# EAGLE design 612_jetracer_328_213 (EAGLE 9.6.2)
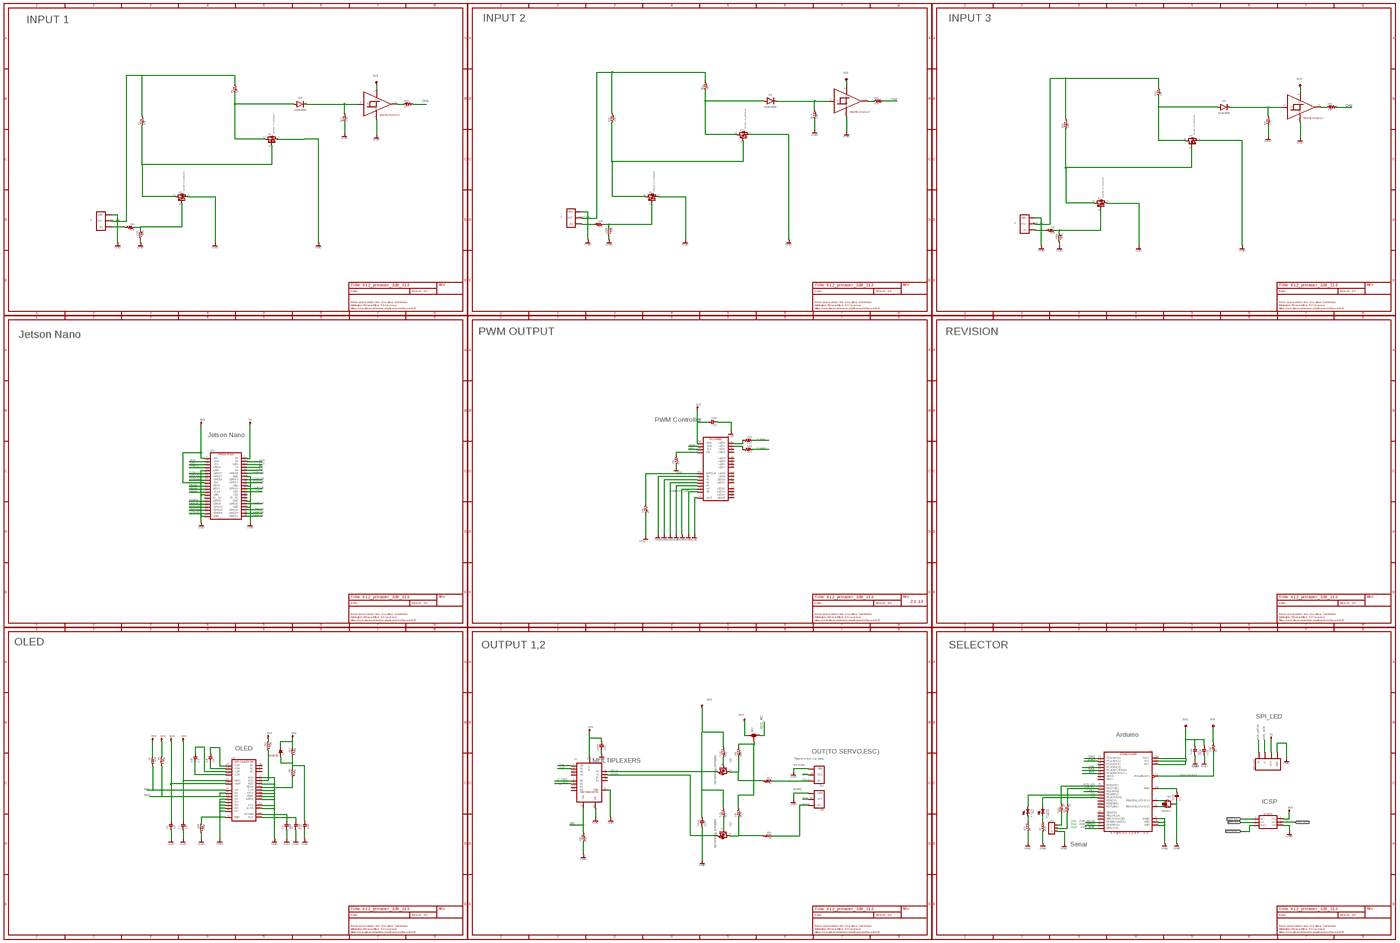
[diagram p0: schematic, sheet 1, overview]
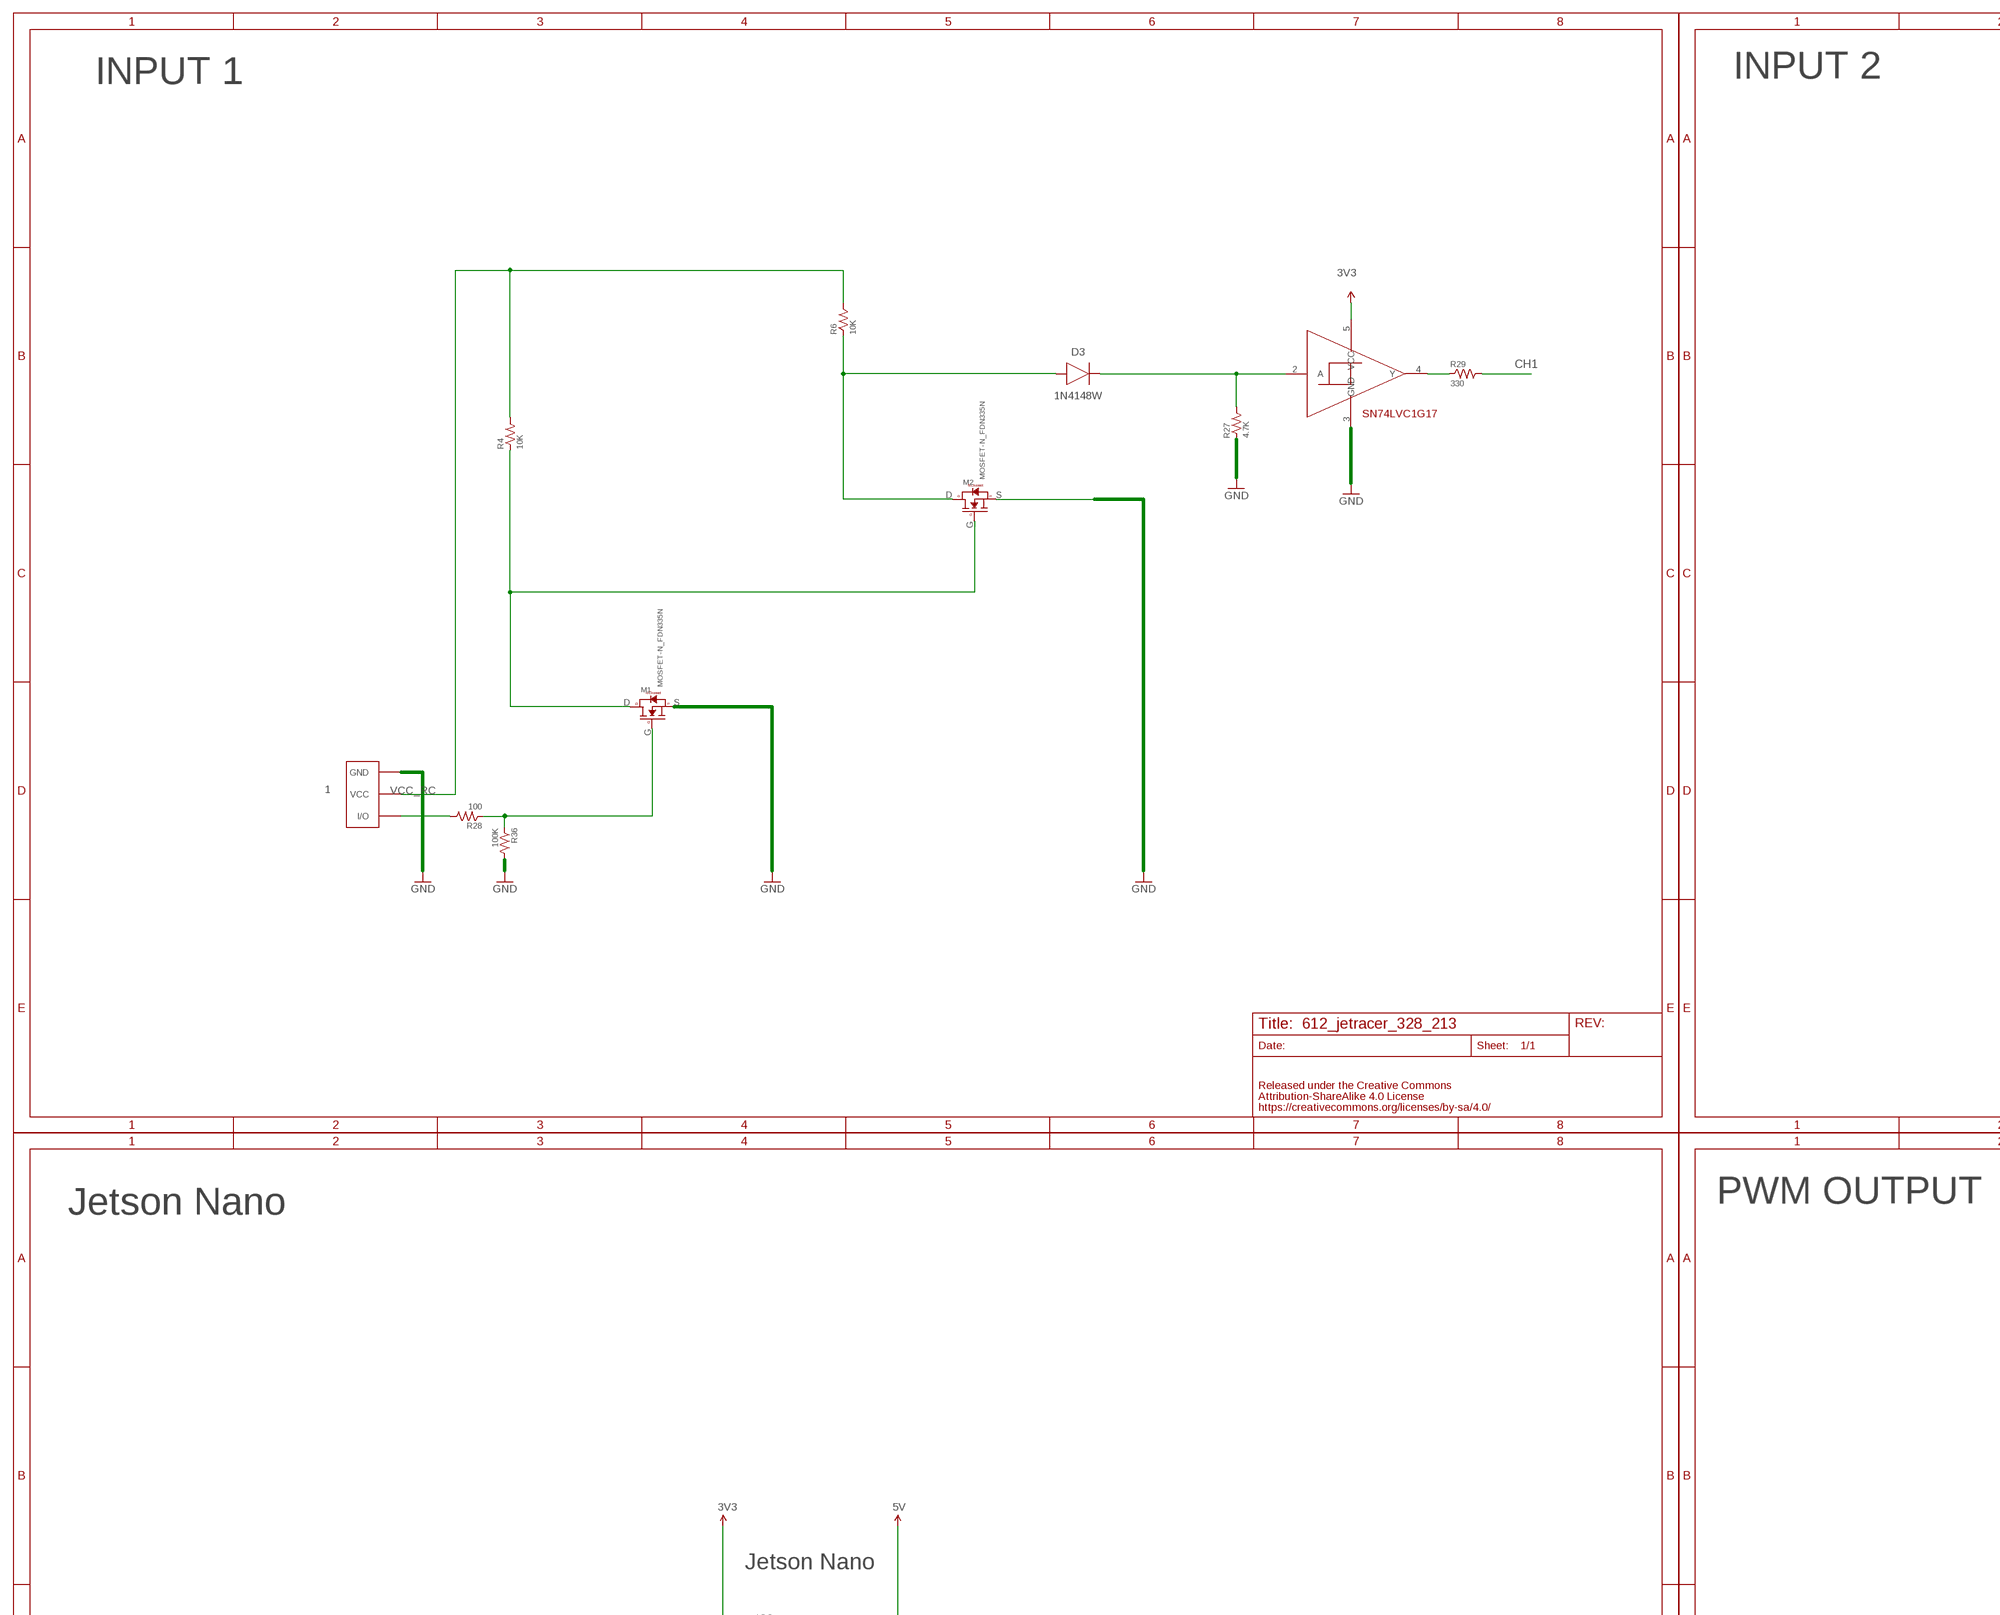
[diagram p1: schematic, sheet 1, part 1 of 6]
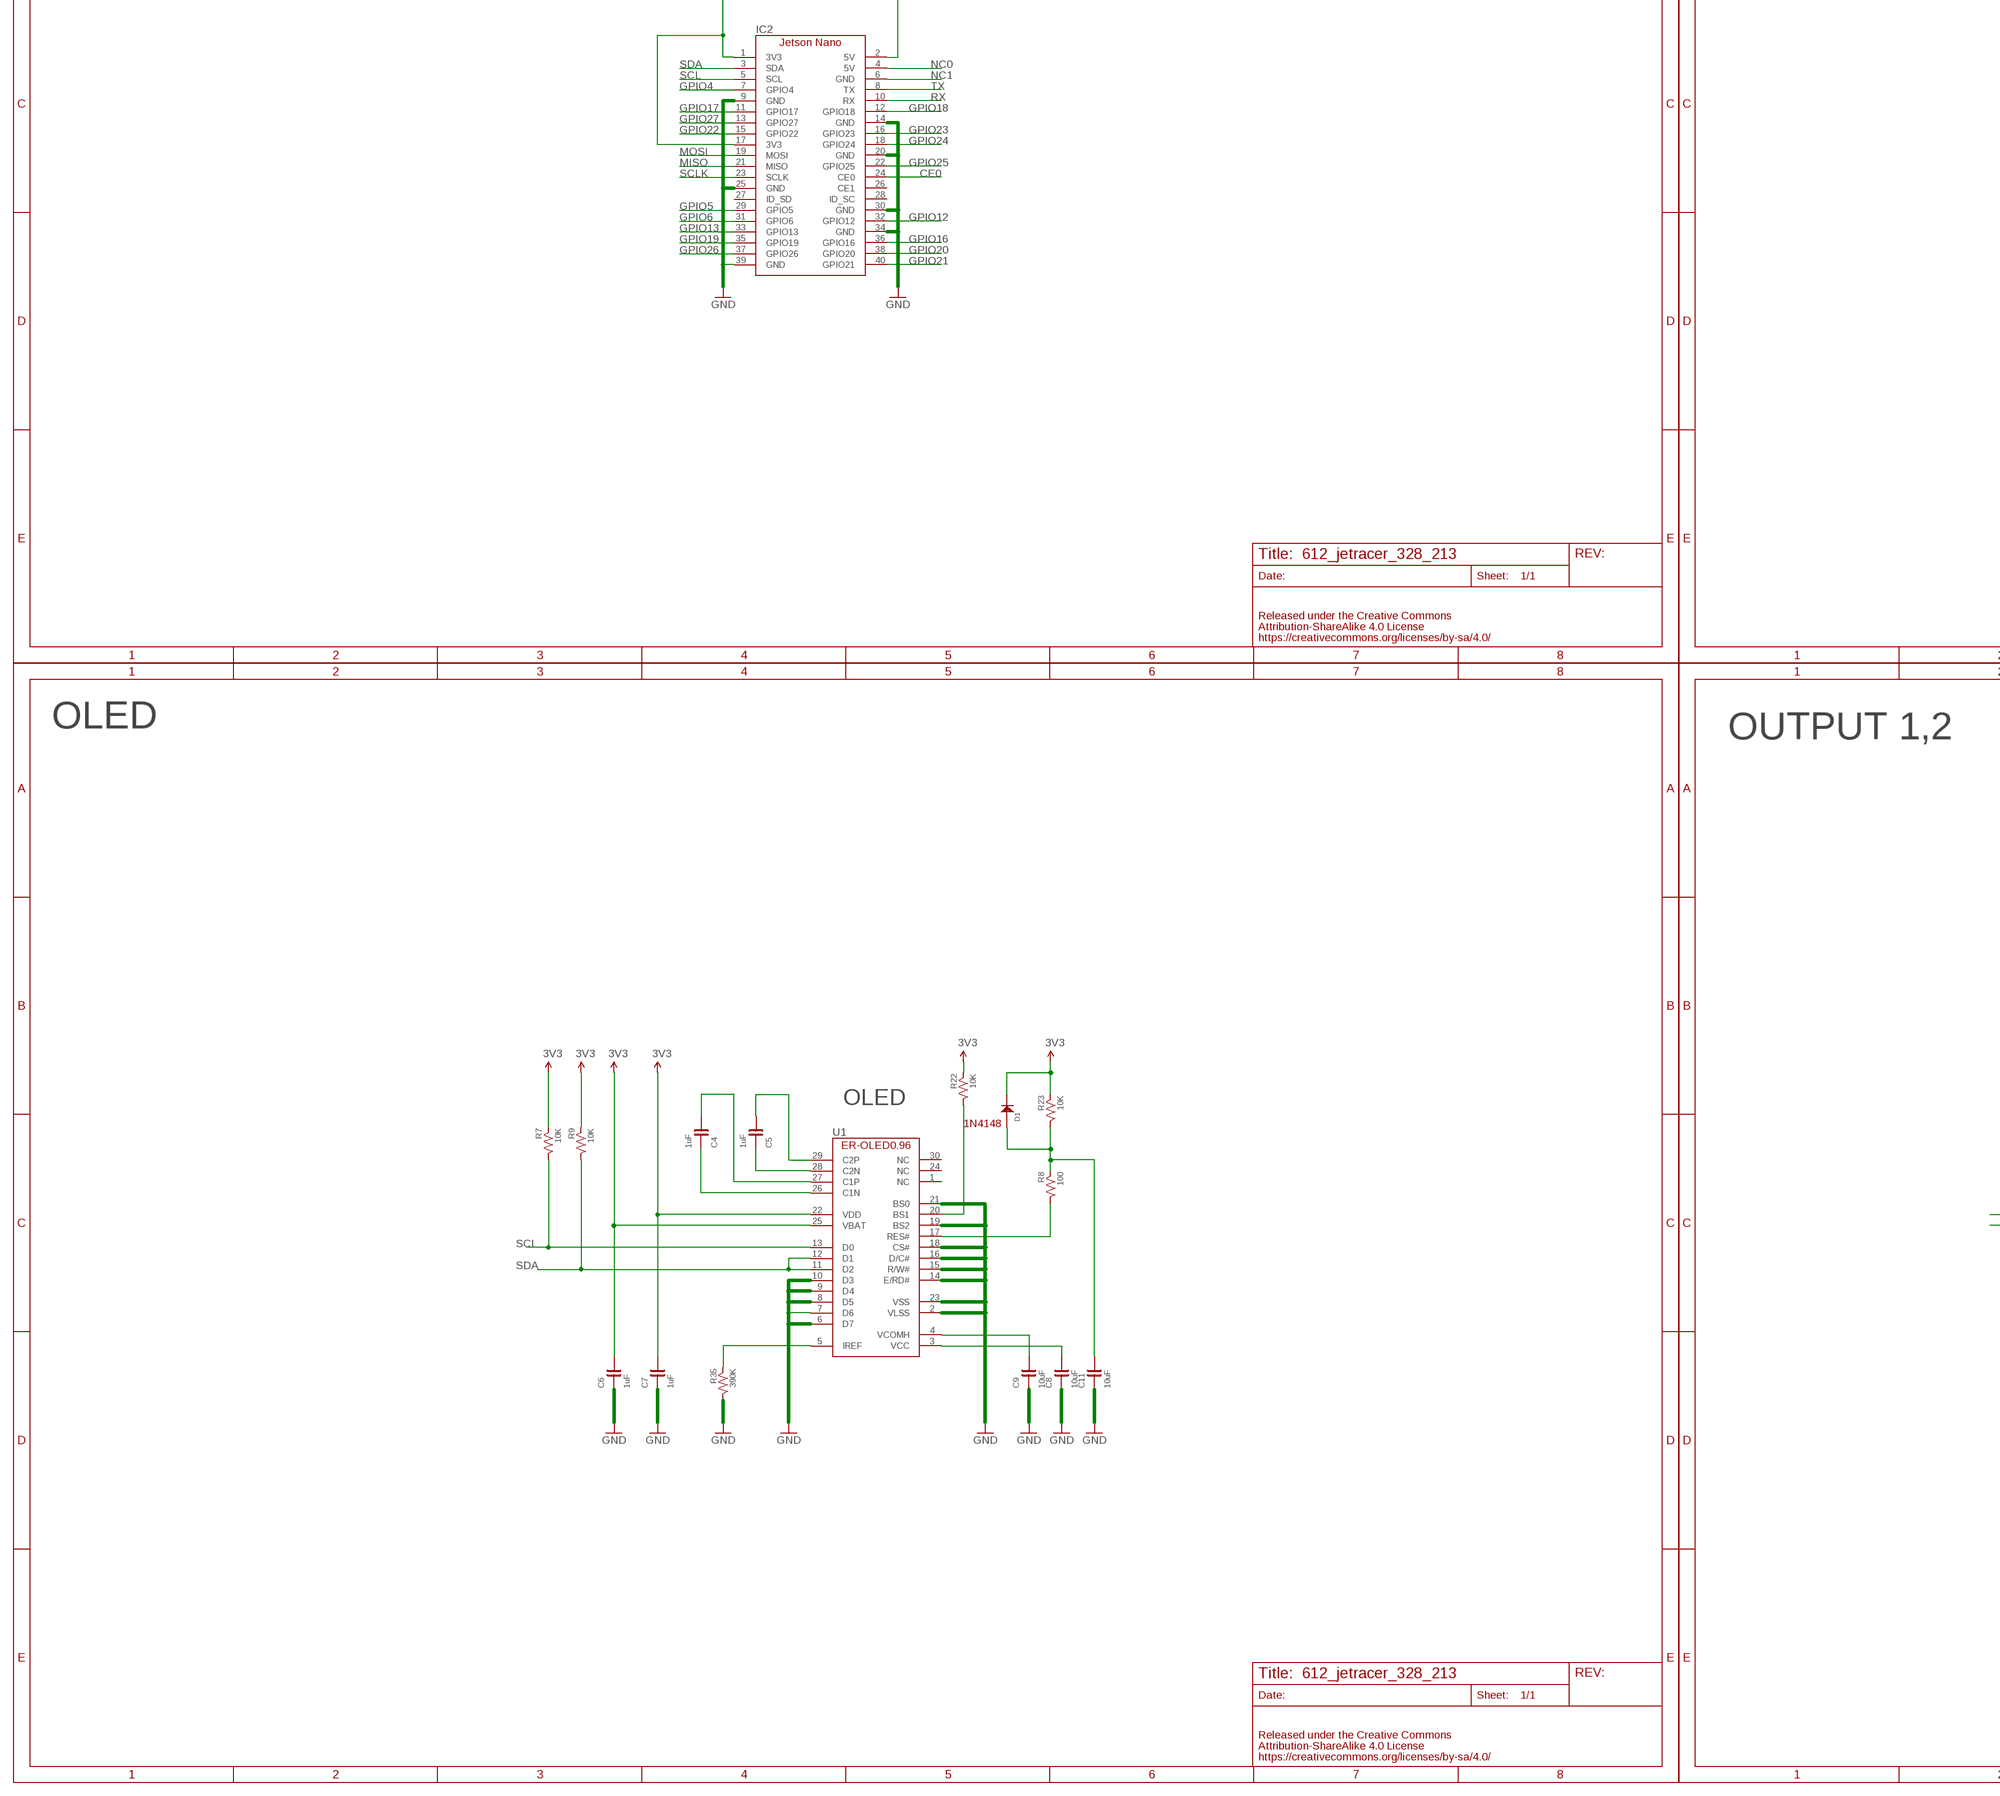
[diagram p2: schematic, sheet 1, part 2 of 6]
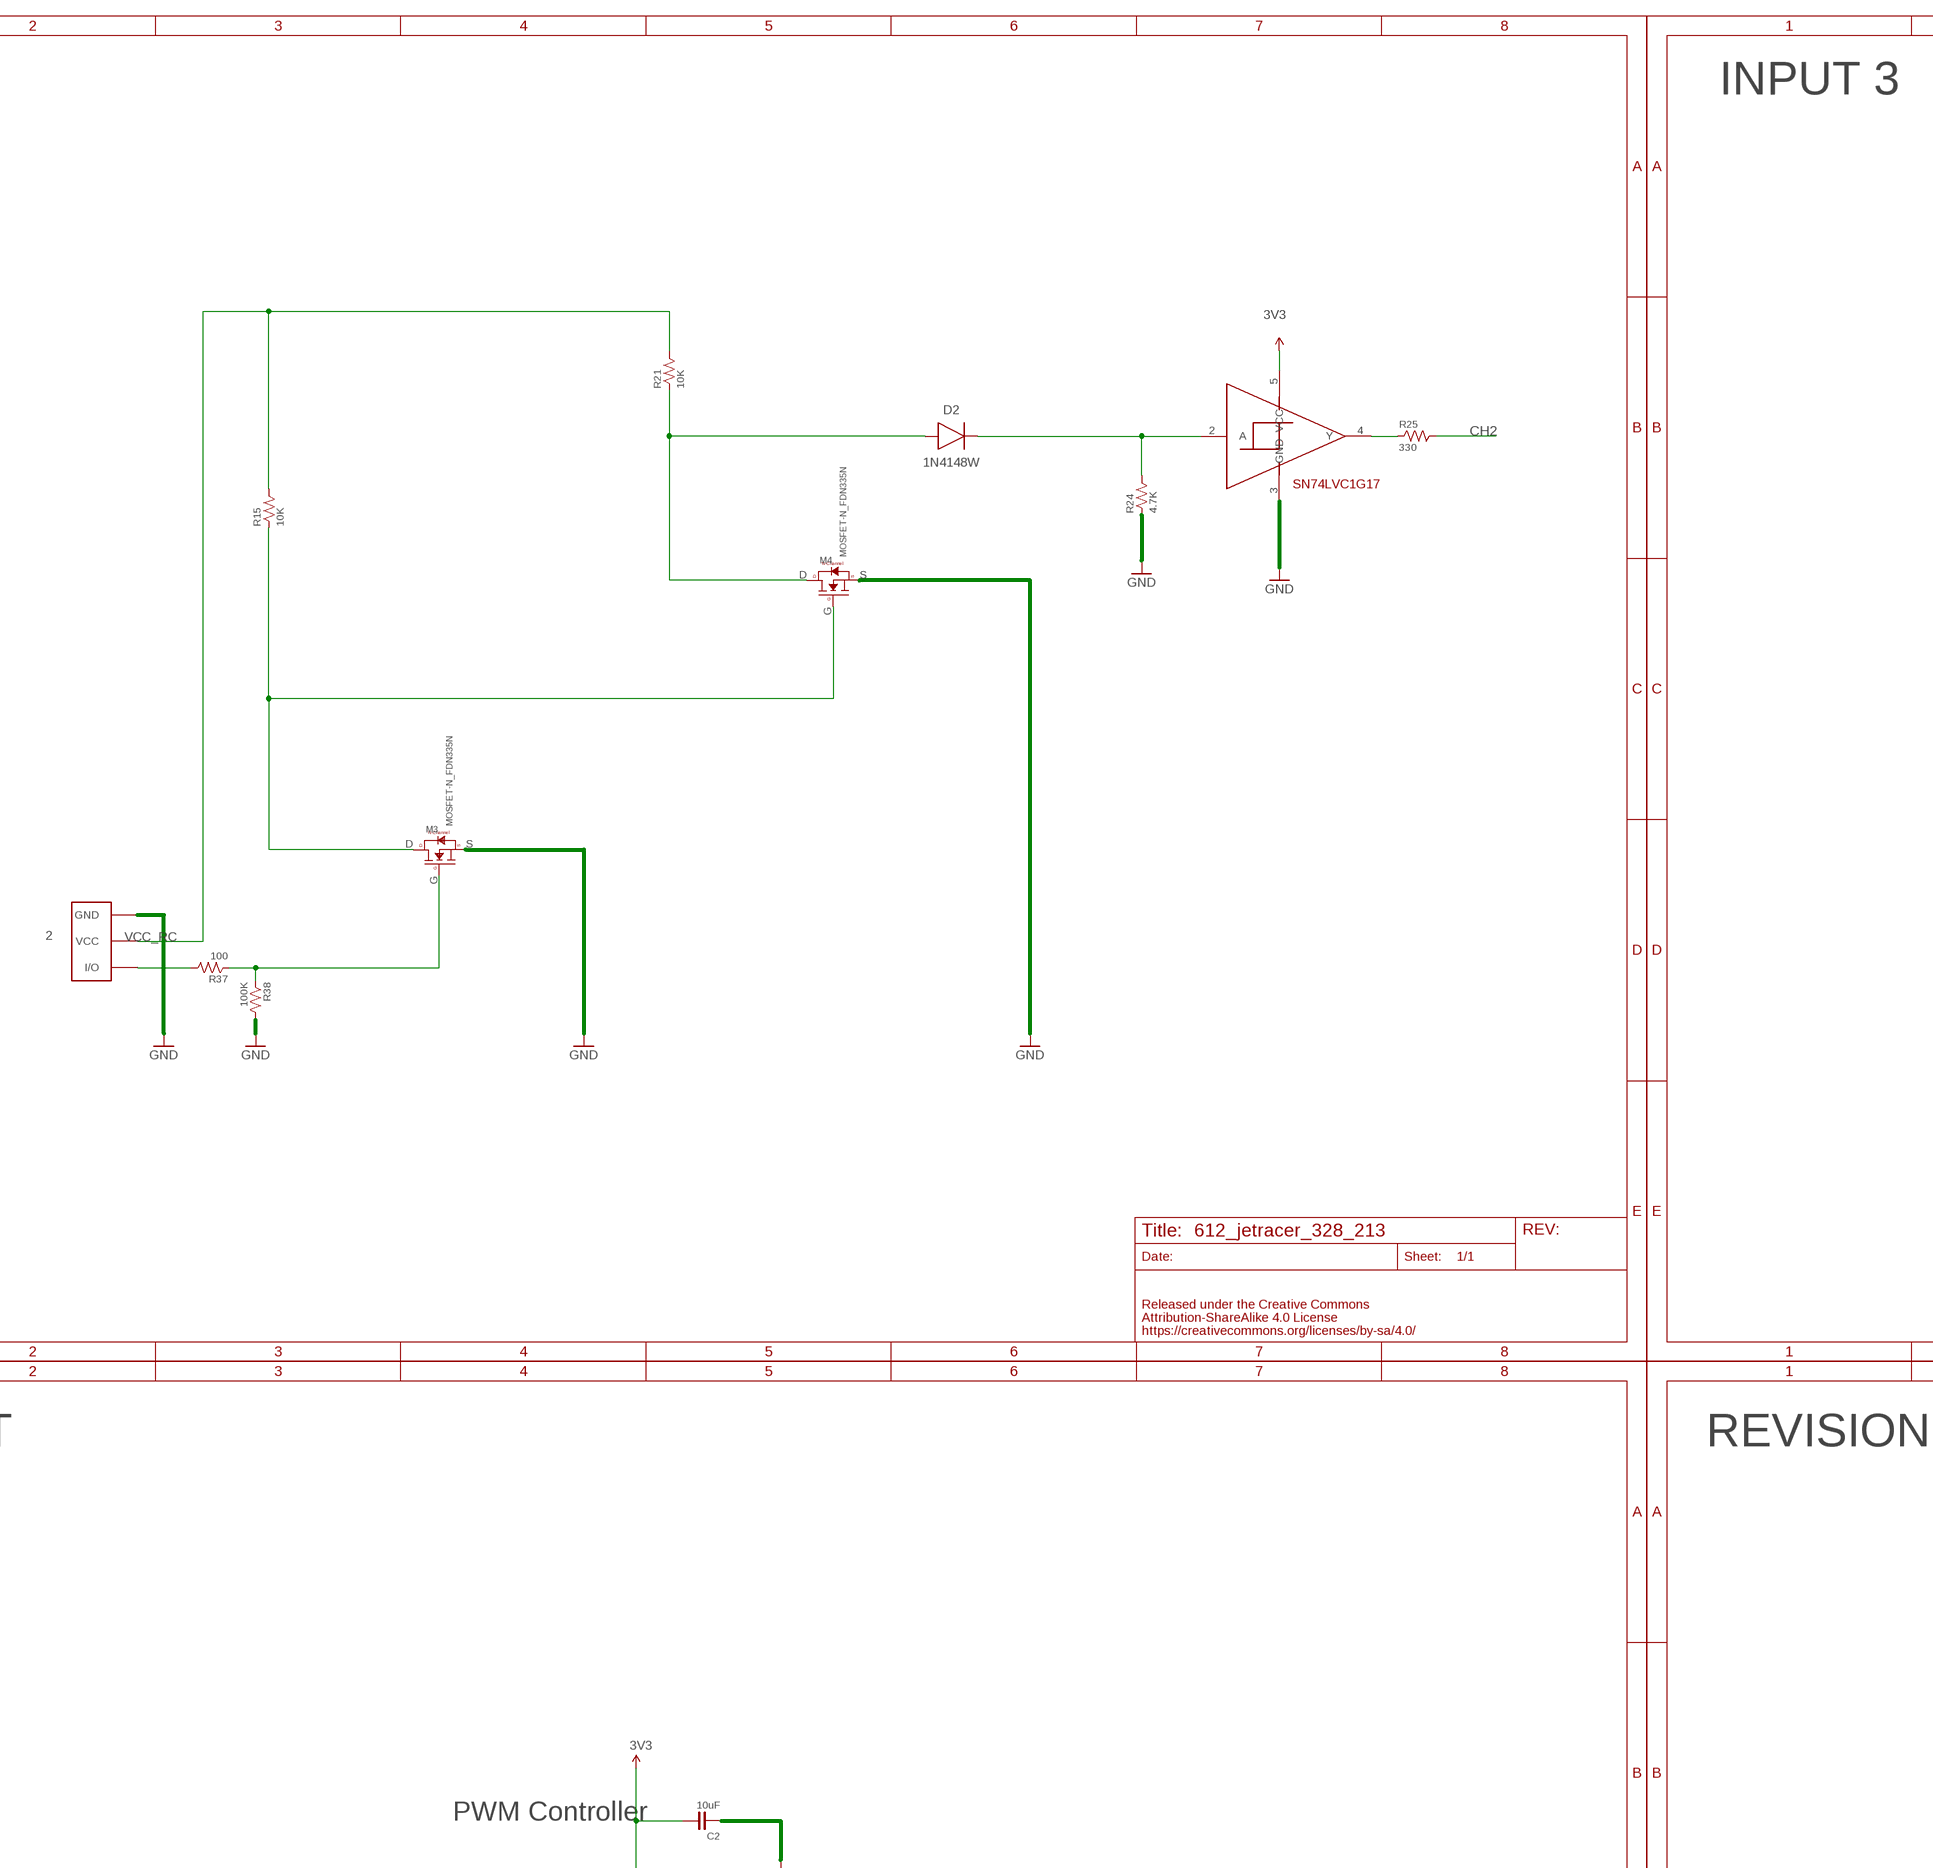
[diagram p3: schematic, sheet 1, part 3 of 6]
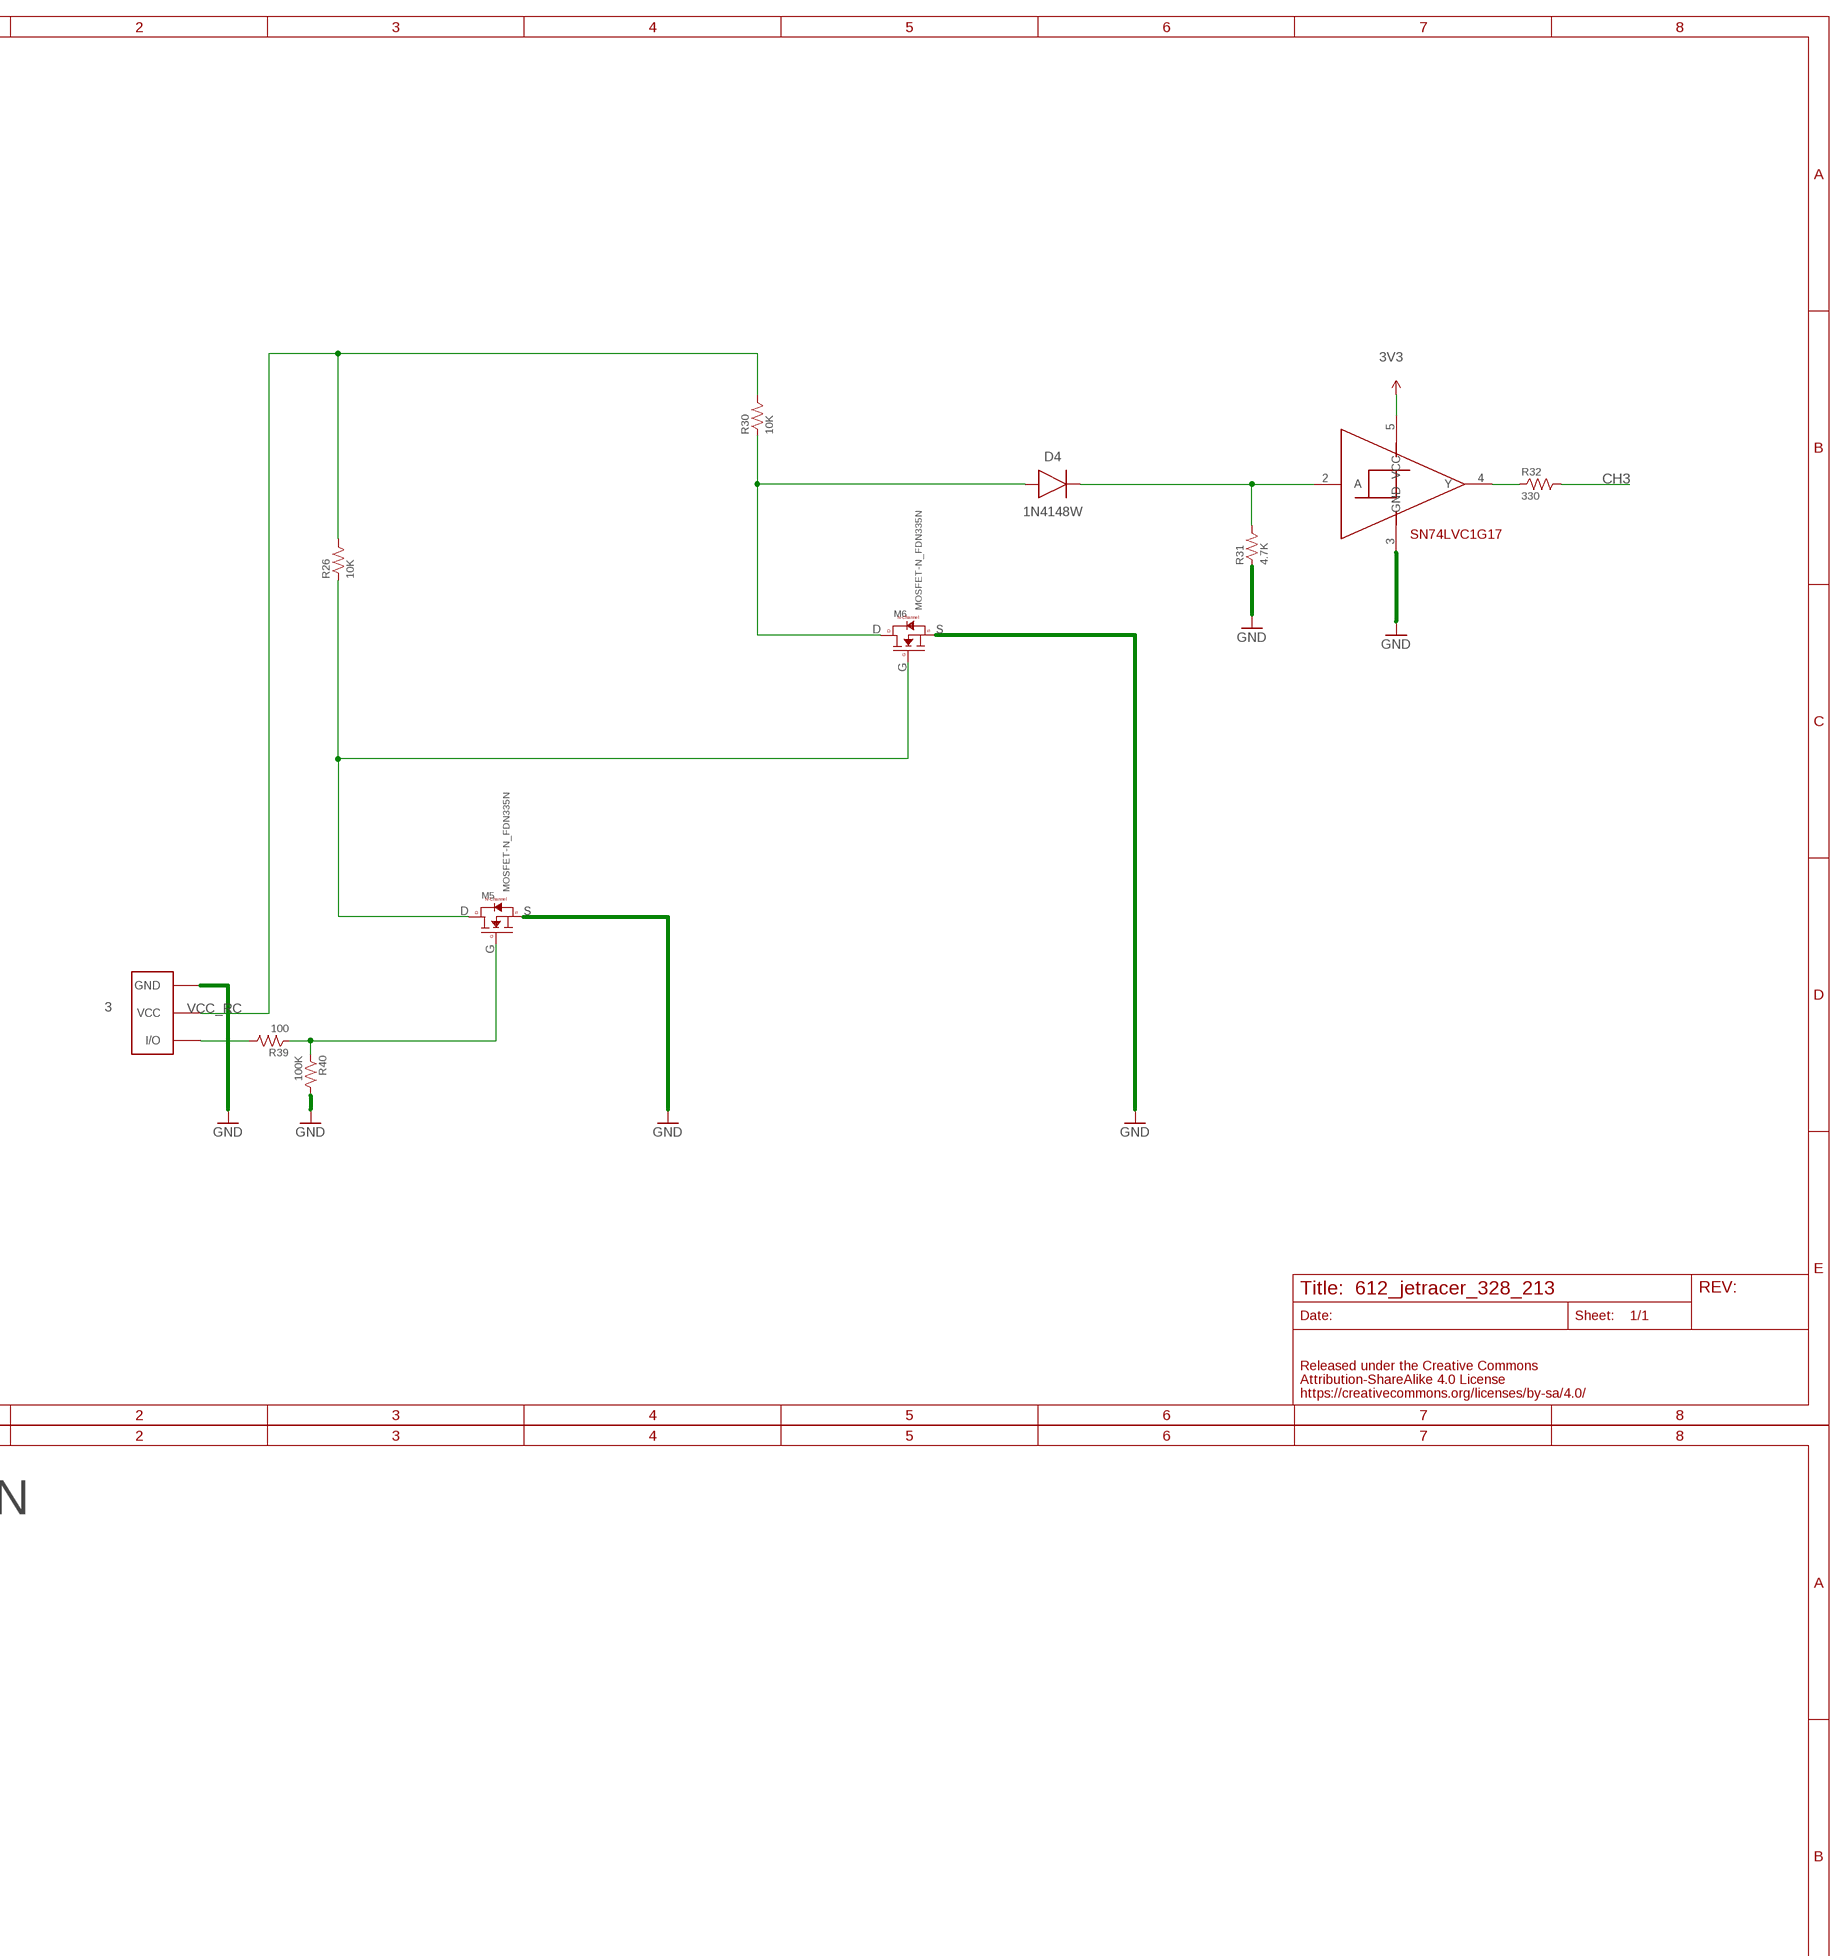
[diagram p4: schematic, sheet 1, part 4 of 6]
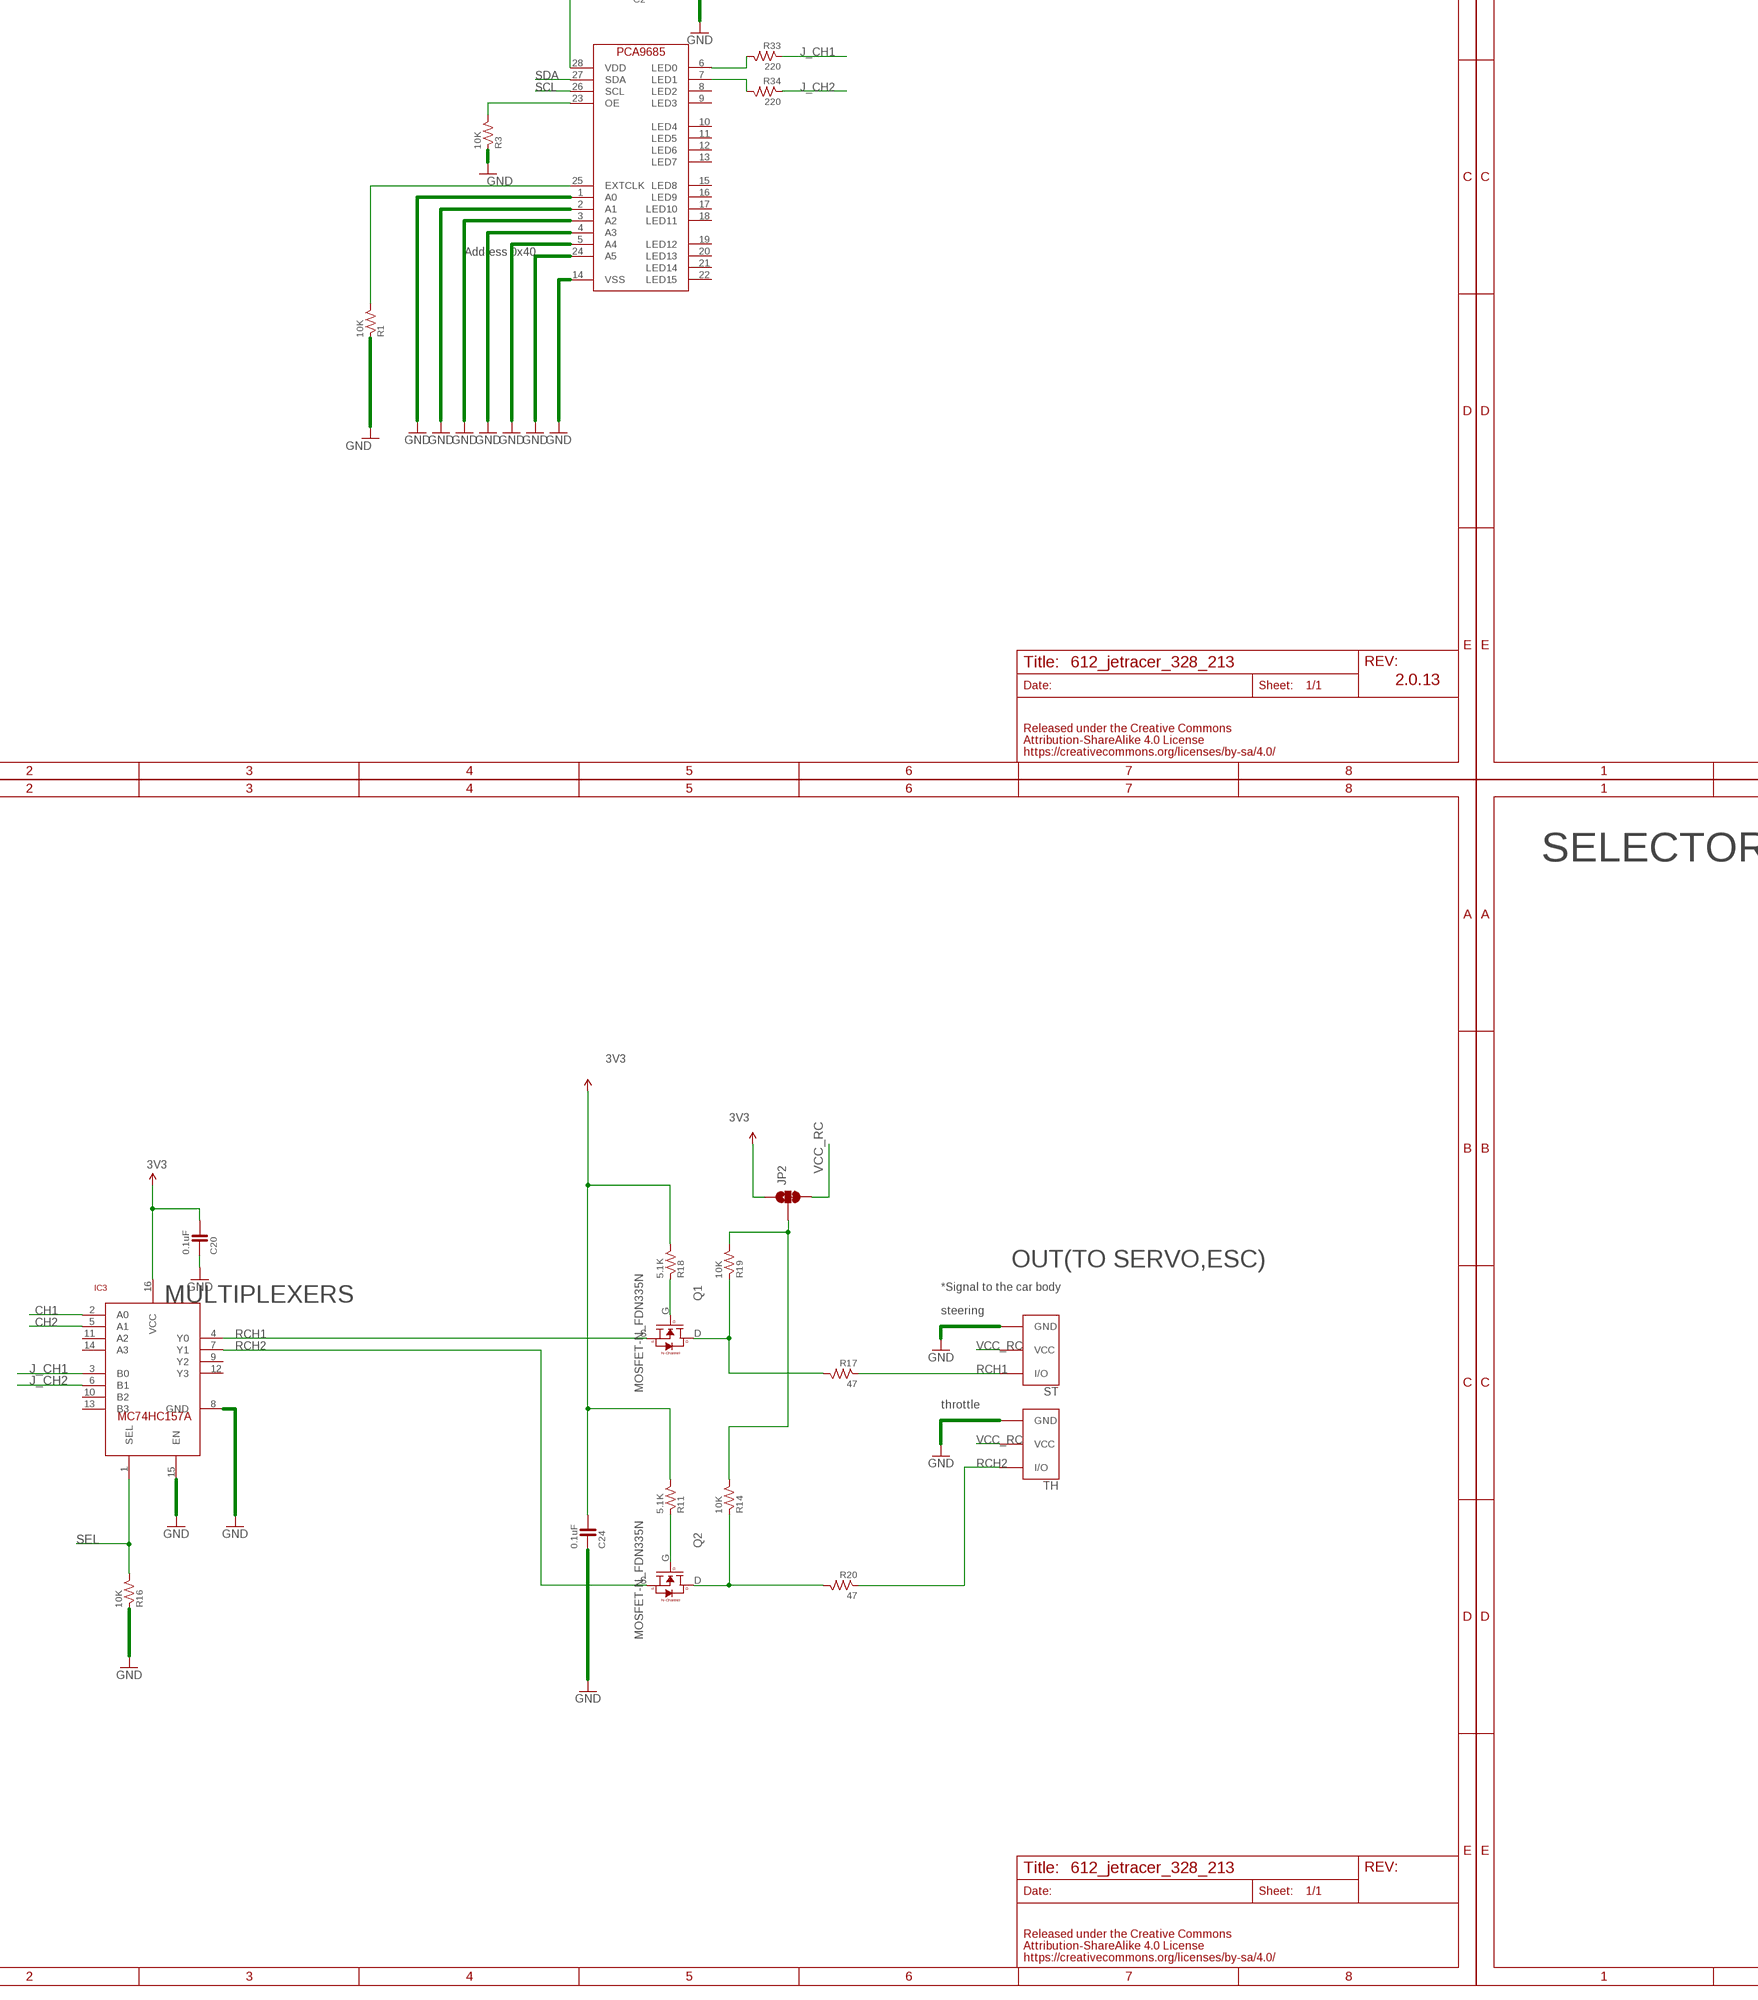
[diagram p5: schematic, sheet 1, part 5 of 6]
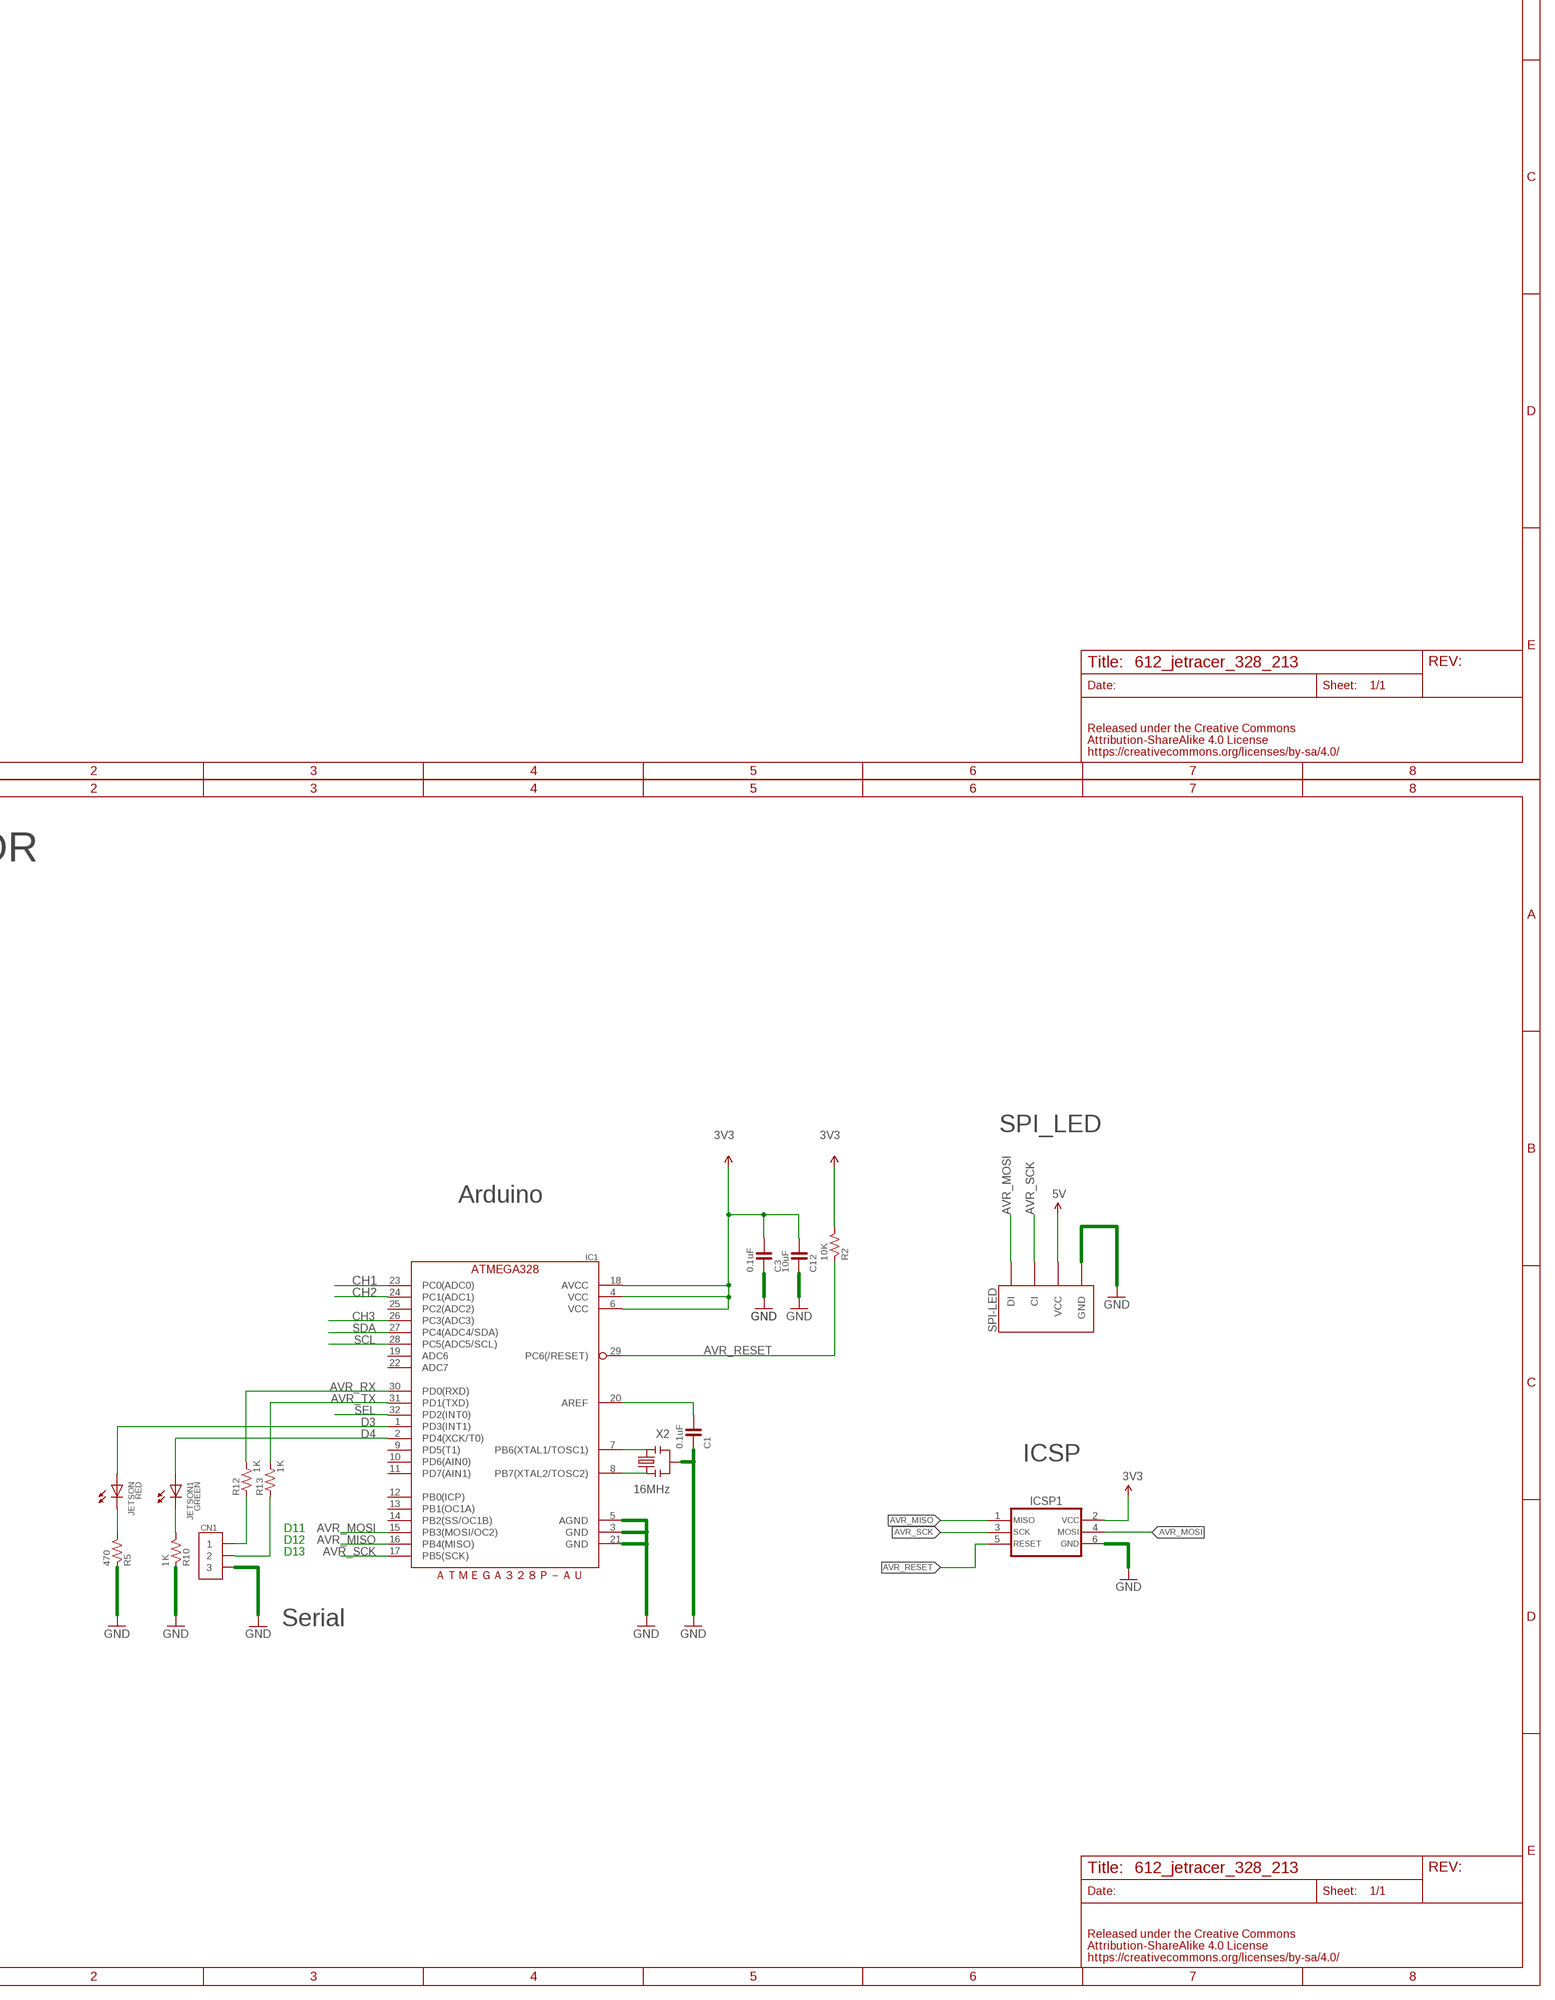
[diagram p6: schematic, sheet 1, part 6 of 6]

## Parts
1  FABO_BRICK_3PIN-HEADER  [FABO_BRICK_3PIN_HEADER]
2  FABO_BRICK_3PIN-HEADER  [FABO_BRICK_3PIN_HEADER]
3  FABO_BRICK_3PIN-HEADER  [FABO_BRICK_3PIN_HEADER]
C1  0.1uF  CAPACITOR-0603  [0603]
C2  10uF  CAPACITOR-0603  [0603]
C3  0.1uF  CAPACITOR-0603  [0603]
C4  1uF  CAPACITOR-0603  [0603]
C5  1uF  CAPACITOR-0603  [0603]
C6  1uF  CAPACITOR-0603  [0603]
C7  1uF  CAPACITOR-0603  [0603]
C8  10uF  CAPACITOR-0603  [0603]
C9  10uF  CAPACITOR-0603  [0603]
C11  10uF  CAPACITOR-0603  [0603]
C12  10uF  CAPACITOR-0603  [0603]
C20  0.1uF  CAPACITOR-0603  [0603]
C24  0.1uF  CAPACITOR-0603  [0603]
CN1  PIN_1X3  [PIN_1X3]
D1  1N4148  [1N4148W]
D2  1N4148W  DIODE_1N4148W-7-F_SOD123G  [SOD3715X135]
D3  1N4148W  DIODE_1N4148W-7-F_SOD123G  [SOD3715X135]
D4  1N4148W  DIODE_1N4148W-7-F_SOD123G  [SOD3715X135]
IC1  ATMEGA328P-AU  [TQFP-32]
IC2  JETSON_NANO_NOBORDER  [JETSON_NANO_NOBOARDER]
IC3  MULTIPLEXERSMC74HC157A  [TSSOP-16]
IC4  PCA9685  [PCA9685]
ICSP1  ICSP_AVR-TC_NOHOLE  [TC2030]
JETSON  GREEN  LED-0603  [0603]
JETSON1  RED  LED-0603  [0603]
JP2  JUMPER-SMT_3_1-NC_TRACE_SILK  [SMT-JUMPER_3_1-NC_TRACE_SILK]
M1  MOSFET-N_FDN335N  [SUPERSOT-3]
M2  MOSFET-N_FDN335N  [SUPERSOT-3]
M3  MOSFET-N_FDN335N  [SUPERSOT-3]
M4  MOSFET-N_FDN335N  [SUPERSOT-3]
M5  MOSFET-N_FDN335N  [SUPERSOT-3]
M6  MOSFET-N_FDN335N  [SUPERSOT-3]
Q1  MOSFET-N_FDN335N  [SUPERSOT-3]
Q2  MOSFET-N_FDN335N  [SUPERSOT-3]
R1  10K  RESISTOR-0603  [0603]
R2  10K  RESISTOR-0603  [0603]
R3  10K  RESISTOR-0603  [0603]
R4  10K  RESISTOR-0603  [0603]
R5  470  RESISTOR-0603  [0603]
R6  10K  RESISTOR-0603  [0603]
R7  10K  RESISTOR-0603  [0603]
R8  100  RESISTOR-0603  [0603]
R9  10K  RESISTOR-0603  [0603]
R10  1K  RESISTOR-0603  [0603]
R11  5.1K  RESISTOR-0603  [0603]
R12  1K  RESISTOR-0603  [0603]
R13  1K  RESISTOR-0603  [0603]
R14  10K  RESISTOR-0603  [0603]
R15  10K  RESISTOR-0603  [0603]
R16  10K  RESISTOR-0603  [0603]
R17  47  RESISTOR-0603  [0603]
R18  5.1K  RESISTOR-0603  [0603]
R19  10K  RESISTOR-0603  [0603]
R20  47  RESISTOR-0603  [0603]
R21  10K  RESISTOR-0603  [0603]
R22  10K  RESISTOR-0603  [0603]
R23  10K  RESISTOR-0603  [0603]
R24  4.7K  RESISTOR-0603  [0603]
R25  330  RESISTOR-0603  [0603]
R26  10K  RESISTOR-0603  [0603]
R27  4.7K  RESISTOR-0603  [0603]
R28  100  RESISTOR-0603  [0603]
R29  330  RESISTOR-0603  [0603]
R30  10K  RESISTOR-0603  [0603]
R31  4.7K  RESISTOR-0603  [0603]
R32  330  RESISTOR-0603  [0603]
R33  220  RESISTOR-0603  [0603]
R34  220  RESISTOR-0603  [0603]
R35  390K  RESISTOR-0603  [0603]
R36  100K  RESISTOR-0603  [0603]
R37  100  RESISTOR-0603  [0603]
R38  100K  RESISTOR-0603  [0603]
R39  100  RESISTOR-0603  [0603]
R40  100K  RESISTOR-0603  [0603]
SPI-LED  FABO-SPI-LED-B04B  [SPI-B04B-PASK-1]
ST  FABO_BRICK_3PIN-HEADER  [FABO_BRICK_3PIN_HEADER]
TH  FABO_BRICK_3PIN-HEADER  [FABO_BRICK_3PIN_HEADER]
U1  ER-OLED0.96-1ER-CON30HT-1  [ER-CON30HT-1]
U$14  SN74LVC1G17  [SOT-23]
U$20  SN74LVC1G17  [SOT-23]
U$23  SN74LVC1G17  [SOT-23]
X2  16MHz  RESONATOR  [CSTNE_V_C]

## Nets
3V3: C2.2 C3.2 C6.2 C7.2 C12.2 C20.2 C24.2 D1.CATHODE IC1.4(VCC) IC1.6(VCC) IC1.18(AVCC) IC2.1(3V3) IC2.17(3V3) IC3.16(VCC) IC4.28(VDD) ICSP1.2 JP2.1 R2.2 R7.1 R9.1 R11.2 R18.2 R22.1 R23.1 U1.22(VDD) U1.25(VBAT) U$14.5(VCC) U$20.5(VCC) U$23.5(VCC)
5V: IC2.2(5V) SPI-LED.VCC
AVR_MISO: IC1.16(PB4(MISO)) ICSP1.1
AVR_MOSI: IC1.15(PB3(MOSI/OC2)) ICSP1.4 SPI-LED.DI
AVR_RESET: IC1.29(PC6(/RESET)) ICSP1.5 R2.1
AVR_RX: IC1.30(PD0(RXD)) R12.2
AVR_SCK: IC1.17(PB5(SCK)) ICSP1.3 SPI-LED.CI
AVR_TX: IC1.31(PD1(TXD)) R13.2
CE0: IC2.24(CE0)
CH1: IC1.23(PC0(ADC0)) IC3.2(A0) R29.2
CH2: IC1.24(PC1(ADC1)) IC3.5(A1) R25.2
CH3: IC1.26(PC3(ADC3)) R32.2
D3: IC1.1(PD3(INT1)) JETSON1.ANODE
D4: IC1.2(PD4(XCK/T0)) JETSON.ANODE
GND: 1.GND 2.GND 3.GND C1.1 C2.1 C3.1 C6.1 C7.1 C8.1 C9.1 C11.1 C12.1 C20.1 C24.1 CN1.3 IC1.3(GND) IC1.5(AGND) IC1.21(GND) IC2.9(GND) IC2.14(GND) IC2.20(GND) IC2.25(GND) IC2.30(GND) IC2.34(GND) IC2.39(GND) IC3.8(GND) IC3.15(EN) IC4.1(A0) IC4.2(A1) IC4.3(A2) IC4.4(A3) IC4.5(A4) IC4.14(VSS) IC4.24(A5) ICSP1.6 M1.S M2.S M3.S M4.S M5.S M6.S R1.1 R3.1 R5.1 R10.1 R16.1 R24.1 R27.1 R31.1 R35.2 R36.2 R38.2 R40.2 SPI-LED.GND ST.GND TH.GND U1.2(VLSS) U1.6(D7) U1.7(D6) U1.8(D5) U1.9(D4) U1.10(D3) U1.14(E/RD#) U1.15(R/W#) U1.16(D/C#) U1.18(CS#) U1.19(BS2) U1.21(BS0) U1.23(VSS) U$14.3(GND) U$20.3(GND) U$23.3(GND) X2.2
GPIO4: IC2.7(GPIO4)
GPIO5: IC2.29(GPIO5)
GPIO6: IC2.31(GPIO6)
GPIO12: IC2.32(GPIO12)
GPIO13: IC2.33(GPIO13)
GPIO16: IC2.36(GPIO16)
GPIO17: IC2.11(GPIO17)
GPIO18: IC2.12(GPIO18)
GPIO19: IC2.35(GPIO19)
GPIO20: IC2.38(GPIO20)
GPIO21: IC2.40(GPIO21)
GPIO22: IC2.15(GPIO22)
GPIO23: IC2.16(GPIO23)
GPIO24: IC2.18(GPIO24)
GPIO25: IC2.22(GPIO25)
GPIO26: IC2.37(GPIO26)
GPIO27: IC2.13(GPIO27)
J_CH1: IC3.3(B0) R33.1
J_CH2: IC3.6(B1) R34.1
MISO: IC2.21(MISO)
MOSI: IC2.19(MOSI)
N$2: M1.G R28.1 R36.1
N$3: Q1.D R17.2 R19.1
N$4: C1.2 IC1.20(AREF)
N$5: IC1.8(PB7(XTAL2/TOSC2)) X2.3
N$6: CN1.1 R12.1
N$7: IC4.23(OE) R3.2
N$8: IC4.25(EXTCLK) R1.2
N$9: Q2.D R14.1 R20.2
N$10: R17.1 ST.I/O
N$11: M1.D M2.G R4.1
N$12: D3.2(A) M2.D R6.1
N$13: 2.I/O R37.2
N$14: R20.1 TH.I/O
N$15: IC1.7(PB6(XTAL1/TOSC1)) X2.1
N$16: C4.2 U1.27(C1P)
N$17: CN1.2 R13.1
N$18: M3.D M4.G R15.1
N$19: JETSON1.CATHODE R5.2
N$20: JETSON.CATHODE R10.2
N$21: C4.1 U1.26(C1N)
N$22: C5.1 U1.28(C2N)
N$23: C5.2 U1.29(C2P)
N$24: R35.1 U1.5(IREF)
N$25: C9.2 U1.4(VCOMH)
N$26: C8.2 U1.3(VCC)
N$27: R8.2 U1.17(RES#)
N$28: C11.2 D1.ANODE R8.1 R23.2
N$29: D2.2(A) M4.D R21.1
N$30: D2.1(C) R24.2 U$20.2(A)
N$31: R25.1 U$20.4(Y)
N$32: 3.I/O R39.2
N$33: M5.D M6.G R26.1
N$34: D3.1(C) R27.2 U$14.2(A)
N$35: R29.1 U$14.4(Y)
N$36: D4.2(A) M6.D R30.1
N$37: D4.1(C) R31.2 U$23.2(A)
N$38: R32.1 U$23.4(Y)
N$39: Q2.G R11.1
N$40: Q1.G R18.1
N$41: JP2.2 R14.2 R19.2
N$42: IC4.6(LED0) R33.2
N$43: IC4.7(LED1) R34.2
N$44: 1.I/O R28.2
N$45: M3.G R37.1 R38.1
N$46: M5.G R39.1 R40.1
N$50: R22.2 U1.20(BS1)
NC0: IC2.4(5V)
NC1: IC2.6(GND)
RCH1: IC3.4(Y0) Q1.S
RCH2: IC3.7(Y1) Q2.S
RX: IC2.10(RX)
SCL: IC1.28(PC5(ADC5/SCL)) IC2.5(SCL) IC4.26(SCL) R7.2 U1.13(D0)
SCLK: IC2.23(SCLK)
SDA: IC1.27(PC4(ADC4/SDA)) IC2.3(SDA) IC4.27(SDA) R9.2 U1.11(D2) U1.12(D1)
SEL: IC1.32(PD2(INT0)) IC3.1(SEL) R16.2
TX: IC2.8(TX)
VCC_RC: 1.VCC 2.VCC 3.VCC JP2.3 R4.2 R6.2 R15.2 R21.2 R26.2 R30.2 ST.VCC TH.VCC
Unconnected: IC1.9(PD5(T1)) IC1.10(PD6(AIN0)) IC1.11(PD7(AIN1)) IC1.12(PB0(ICP)) IC1.13(PB1(OC1A)) IC1.14(PB2(SS/OC1B)) IC1.19(ADC6) IC1.22(ADC7) IC1.25(PC2(ADC2)) IC2.26(CE1) IC2.27(ID_SD) IC2.28(ID_SC) IC3.9(Y2) IC3.10(B2) IC3.11(A2) IC3.12(Y3) IC3.13(B3) IC3.14(A3) IC4.8(LED2) IC4.9(LED3) IC4.10(LED4) IC4.11(LED5) IC4.12(LED6) IC4.13(LED7) IC4.15(LED8) IC4.16(LED9) IC4.17(LED10) IC4.18(LED11) IC4.19(LED12) IC4.20(LED13) IC4.21(LED14) IC4.22(LED15) U1.1(NC) U1.24(NC) U1.30(NC)

## Notes on the sheet
- INPUT 1 | INPUT 2 | INPUT 3
- SN74LVC1G17
- SN74LVC1G17
- SN74LVC1G17
- Jetson Nano | PWM OUTPUT | REVISION
- PWM Controller
- Jetson Nano
- Address 0x40
- 2.0.13
- OLED | OUTPUT 1,2 | SELECTOR
- SPI_LED
- Arduino
- OLED
- OUT(TO SERVO,ESC)
- 1N4148
- *Signal to the car body
- MULTIPLEXERS
- steering
- throttle
- MC74HC157A
- ICSP
- D11
- D12
- D13
- ＡＴＭＥＧＡ３２８Ｐ－ＡＵ
- Serial

## Library data of the parts
1-3 ST TH = FaBo-Template:FABO_BRICK_3PIN: FaBo Brick 3pin
C1-C9 C11 C12 C20 = FaBo-Capacitor:CAPACITOR: CAPACITOR
C24 = FaBo-Capacitor:CAPACITOR: CAPACITOR; SPICEPREFIX: C
CN1 = FaBo-PIN:PIN_1X3
D1 = FaBo-Diode:1N4148
D2-D4 = Diode:DIODE_: Diode Rectifier - Popular parts; CATEGORY: Diode; DESCRIPTION: DIODE GEN PURP 100V 300MA SOD123; MANUFACTURER: Diodes Incorporated; SUB-CATEGORY: Rectifier
IC1 = component:ATMEGA328
IC2 = FaBo-Boards:JETSON_NANO
IC3 = FaBo-Multiplexers:MULTIPLEXERS
IC4 = FaBo-Motor:PCA9685
ICSP1 = component:ICSP_AVR
JETSON JETSON1 = FaBo-LED:LED
JP2 = SparkFun-Jumpers:JUMPER-SMT_3_1-NC_TRACE: Normally closed trace jumper (1 of 2 connections) This jumper has a trace between two pads so it's normally closed (NC). The other connection is normally open (NO). Use a razor knife to open the connection. For best results follow the IPC guidelines for cutting traces: Cutout at least 0.063 mm (0.005 in). Remove all loose material to clean up the cut area. Seal the cut with an approved epoxy. Reapply solder to reclose the connection, or to close the NO connection.
M1-M6 Q1 Q2 = FaBo-Mosfet:MOSFET-N
R1-R40 = FaBo-Resistors:RESISTOR: RESISTOR
SPI-LED = FaBo-Connetor:FABO-SPI-LED
U1 = FaBo-Display:ER-OLED0.96-1
U$14 U$20 U$23 = FaBo-LogicIC:SN74LVC1G17
X2 = component:RESONATOR

## Board
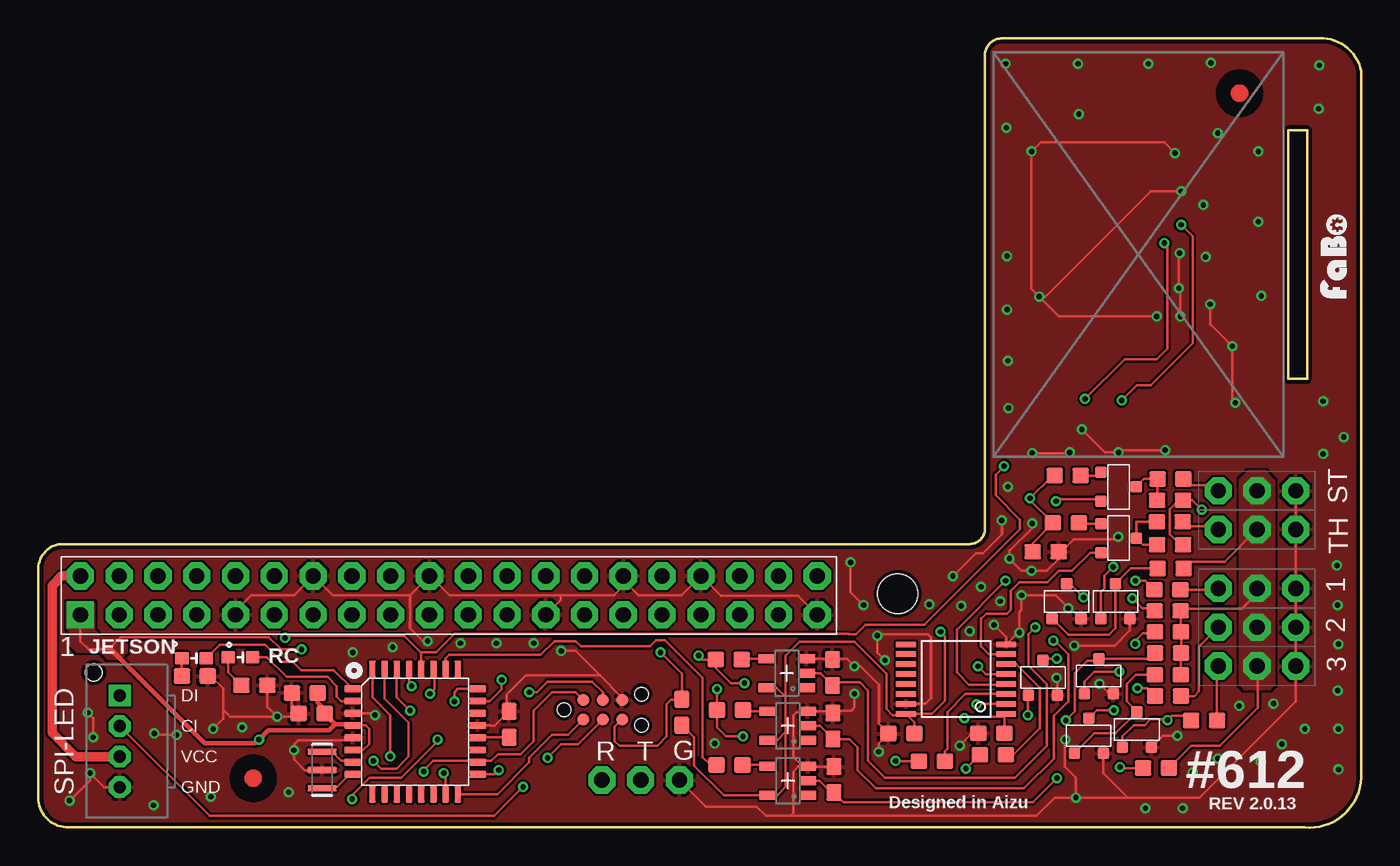
[diagram p7: board, top side]
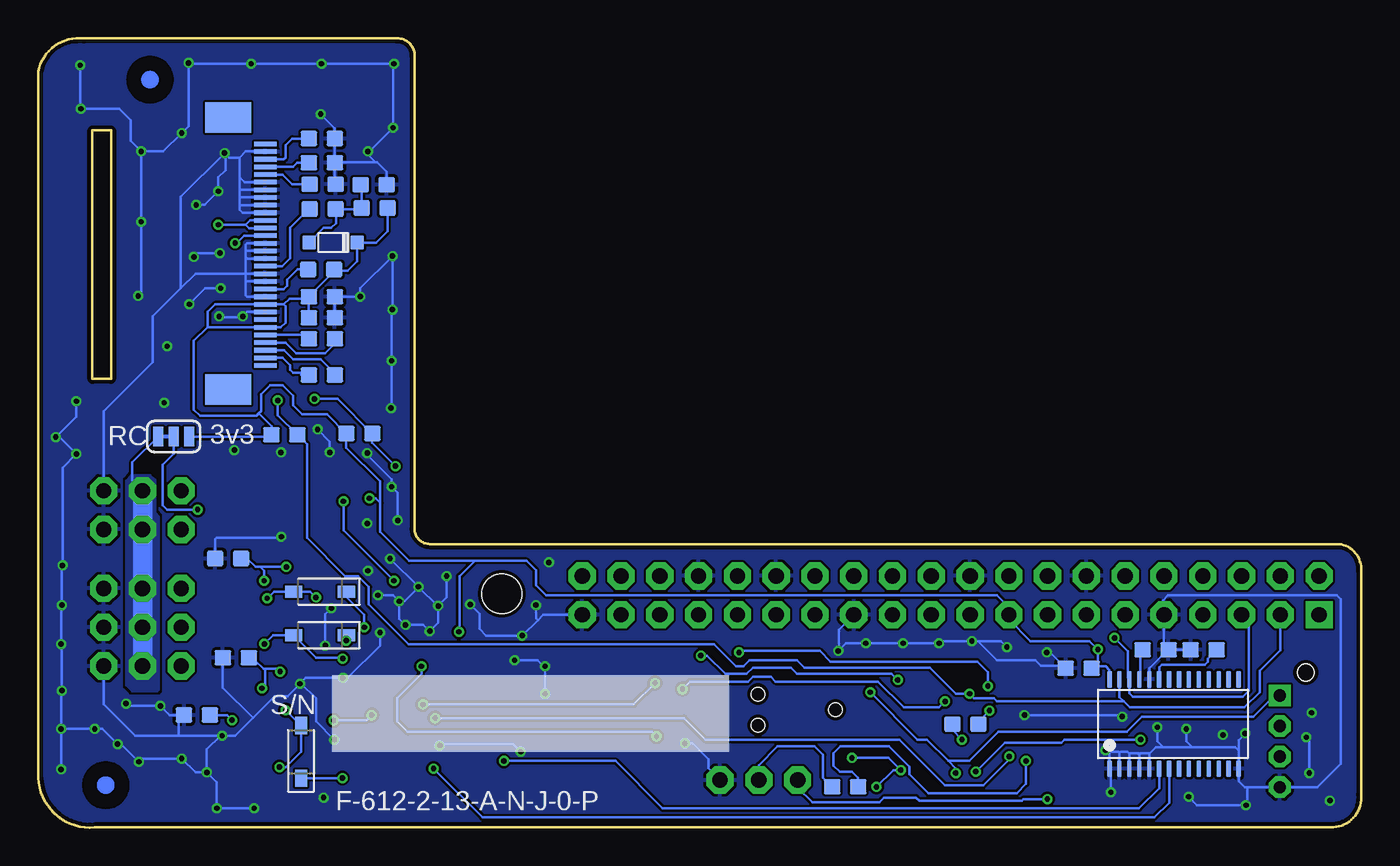
[diagram p8: board, bottom side, seen from below]

Size 86.66 x 51.68 mm. Coordinates in mm from the lower left corner, seen from the top.
Outline: 62.01,50.51 62.01,19.56 arc-90 61.01,18.56 1.46,18.56 arc87 0.01,16.81 0.01,2.16 arc97 2.01,0.01 82.96,0.01 arc93 86.66,3.26 86.66,49.51 arc85 83.66,51.66 63.16,51.66 arc95 62.01,50.51
Outline: 83.11,29.37 83.11,45.65 81.88,45.65 81.88,29.37 83.11,29.37
Copper layers (1*16): Top 0.035mm / dielectric 1.6mm / Bottom 0.035mm
Design rules "PCBway": minimum track width 6mil, minimum drill 12mil, track to track 6mil, track to pad 6mil, pad to pad 6mil, via to via 6mil, smd to smd 6mil, copper to edge 10mil, drill to drill 10mil, minimum pad ring 10mil, minimum via ring 6mil, stop-mask expansion 2mil, vias tented up to drill 100mil, thermal gap 8mil
Holes 2.6 mm at 56.29,15.31
tKeepout: area 62.6,24.2 to 81.8,51
bKeepout: area 17,1.9 to 21,5.6
bRestrict: 7 lines

### Footprints (pad centres in the part's own frame; a part is rotated, then mirrored left to right if it is on the bottom)
FABO_BRICK_3PIN_HEADER = drill 1 pad 1.778 octagon: GND -2.54,0; I/O 2.54,0; VCC 0,0
0603 = smd 1.1 x 1: 1 -0.85,0; 2 0.85,0
PIN_1X3 = drill 1 pad 1.778 octagon: 1 -2.54,0; 2 0,0; 3 2.54,0
1N4148W = smd 0.9 x 0.95: ANODE 0,0; CATHODE 3.15,0
SOD3715X135 = smd 1.127 x 0.784: 1 -1.722,0; 2 1.722,0
TQFP-32 = smd 1.1 x 0.45: 1 -4.1,2.8; 2 -4.1,2; 3 -4.1,1.2; 4 -4.1,0.4; 5 -4.1,-0.4; 6 -4.1,-1.2; 7 -4.1,-2; 8 -4.1,-2.8; 17 4.1,-2.8; 18 4.1,-2; 19 4.1,-1.2; 20 4.1,-0.4; 21 4.1,0.4; 22 4.1,1.2; 23 4.1,2; 24 4.1,2.8 | smd 0.45 x 1.1: 9 -2.8,-4.1; 10 -2,-4.1; 11 -1.2,-4.1; 12 -0.4,-4.1; 13 0.4,-4.1; 14 1.2,-4.1; 15 2,-4.1; 16 2.8,-4.1; 25 2.8,4.1; 26 2,4.1; 27 1.2,4.1; 28 0.4,4.1; 29 -0.4,4.1; 30 -1.2,4.1; 31 -2,4.1; 32 -2.8,4.1
JETSON_NANO_NOBOARDER = drill 1 pad 1.778 square: 1 1.27,1.27 | drill 1 pad 1.778 octagon: 2 1.27,3.81; 3 3.81,1.27; 4 3.81,3.81; 5 6.35,1.27; 6 6.35,3.81; 7 8.89,1.27; 8 8.89,3.81; 9 11.43,1.27; 10 11.43,3.81; 11 13.97,1.27; 12 13.97,3.81; 13 16.51,1.27; 14 16.51,3.81; 15 19.05,1.27; 16 19.05,3.81; 17 21.59,1.27; 18 21.59,3.81; 19 24.13,1.27; 20 24.13,3.81; 21 26.67,1.27; 22 26.67,3.81; 23 29.21,1.27; 24 29.21,3.81; 25 31.75,1.27; 26 31.75,3.81; 27 34.29,1.27; 28 34.29,3.81; 29 36.83,1.27; 30 36.83,3.81; 31 39.37,1.27; 32 39.37,3.81; 33 41.91,1.27; 34 41.91,3.81; 35 44.45,1.27; 36 44.45,3.81; 37 46.99,1.27; 38 46.99,3.81; 39 49.53,1.27; 40 49.53,3.81
TSSOP-16 = smd 0.36 x 1.3: 1 -2.275,-3.28; 2 -1.625,-3.28; 3 -0.975,-3.28; 4 -0.325,-3.28; 5 0.325,-3.28; 6 0.975,-3.28; 7 1.625,-3.28; 8 2.275,-3.28; 9 2.275,3.28; 10 1.625,3.28; 11 0.975,3.28; 12 0.325,3.28; 13 -0.325,3.28; 14 -0.975,3.28; 15 -1.625,3.28; 16 -2.275,3.28
PCA9685 = smd 0.3 x 1.1: 1 -4.15,-2.93; 2 -3.5,-2.93; 3 -2.85,-2.93; 4 -2.2,-2.93; 5 -1.55,-2.93; 6 -0.9,-2.93; 7 -0.25,-2.93; 8 0.4,-2.93; 9 1.05,-2.93; 10 1.7,-2.93; 11 2.35,-2.93; 12 3,-2.93; 13 3.65,-2.93; 14 4.3,-2.93; 15 4.3,2.92; 16 3.65,2.92; 17 3,2.92; 18 2.35,2.92; 19 1.7,2.92; 20 1.05,2.92; 21 0.4,2.92; 22 -0.25,2.92; 23 -0.9,2.92; 24 -1.55,2.92; 25 -2.2,2.92; 26 -2.85,2.92; 27 -3.5,2.92; 28 -4.15,2.92
TC2030 = smd 0.787 x 0.787: 1 1.27,-0.635; 2 1.27,0.635; 3 2.54,-0.635; 4 2.54,0.635; 5 3.81,-0.635; 6 3.81,0.635 | hole 0.889: 0,0; 5.08,-1.016; 5.08,1.016
0603' = smd 0.9 x 0.8: ANODE -0.8,0; CATHODE 0.8,0
SMT-JUMPER_3_1-NC_TRACE_SILK = smd 0.635 x 1.27: 1 -1.016,0; 2 0,0; 3 1.016,0
SUPERSOT-3 = smd 0.76 x 0.76: D 0,1.15; G -0.95,-1.15; S 0.95,-1.15
SPI-B04B-PASK-1 = drill 0.8 pad 1.422 octagon: CI 1,1.27; GND -3,1.27; VCC -1,1.27 | drill 0.8 pad 1.422 square: DI 3,1.27 | hole 1.1: 4.5,2.97
ER-CON30HT-1 = smd 0.3 x 1.5 bottom: 1 7,-0.23; 2 6.5,-0.23; 3 6,-0.23; 4 5.5,-0.23; 5 5,-0.23; 6 4.5,-0.23; 7 4,-0.23; 8 3.5,-0.23; 9 3,-0.23; 10 2.5,-0.23; 11 2,-0.23; 12 1.5,-0.23; 13 1,-0.23; 14 0.5,-0.23; 15 0,-0.23; 16 -0.5,-0.23; 17 -1,-0.23; 18 -1.5,-0.23; 19 -2,-0.23; 20 -2.5,-0.23; 21 -3,-0.23; 22 -3.5,-0.23; 23 -4,-0.23; 24 -4.5,-0.23; 25 -5,-0.23; 26 -5.5,-0.23; 27 -6,-0.23; 28 -6.5,-0.23; 29 -7,-0.23; 30 -7.5,-0.23 | smd 2 x 3 bottom: 31 -9.07,-2.67; 32 8.74,-2.67
SOT-23 = smd 1.1 x 0.6: 1 -1.3,0.95; 2 -1.3,0; 3 -1.3,-0.95; 4 1.3,-0.95; 5 1.3,0.95
CSTNE_V_C = smd 0.4 x 1.9: 1 1.2,0; 2 0,0; 3 -1.2,0

### Placement (x,y rotation side)
1  79.83,15.66 180 top
2  79.83,13.12 180 top
3  79.83,10.58 180 top
C1  30.85,6.76 270 top
C2  18.51,10.43 0 bottom
C3  17.91,7.46 0 top
C4  68.08,32.01 0 bottom
C5  68.08,29.63 180 bottom
C6  68.08,34.76 180 bottom
C7  68.08,33.38 180 bottom
C8  68.08,45.11 180 bottom
C9  68.08,43.53 180 bottom
C11  64.68,42.08 180 bottom
C12  17.46,8.81 0 top
C20  56.54,6.16 0 top
C24  65.98,18.06 180 top
CN1  39.46,3.11 0 top
D1  68.91,38.3 0 bottom
D2  68.2,12.59 180 bottom
D3  68.2,15.45 180 bottom
D4  69.45,4.96 90 bottom
IC1  24.69,6.28 0 top
IC2  1.49,12.66 0 top
IC3  60.12,9.72 90 top
IC4  12.34,6.78 0 bottom
ICSP1  34.44,7.72 0 top
JETSON  GREEN  [0603']  13.25,11.15 180 top
JETSON1  RED  [0603']  10.21,11.08 180 top
JP2  77.78,25.6 180 bottom
M1  70.56,14.81 0 top
M2  67.36,14.81 0 top
M3  69.46,9.91 0 top
M4  65.81,9.81 0 top
M5  71.96,6.41 0 top
M6  68.81,6.01 0 top
Q1  70.75,22.3 270 top
Q2  70.77,18.95 270 top
R1  13.48,11.65 180 bottom
R2  42.15,7.55 270 top
R3  10.33,11.65 0 bottom
R4  74.16,16.96 0 top
R5  10.26,9.92 180 top
R6  73.96,14.19 0 top
R7  65.63,25.79 0 bottom
R8  68.03,40.49 180 bottom
R9  70.53,25.72 0 bottom
R10  14.16,9.32 180 top
R11  67.3,19.95 180 top
R12  25.93,6.77 0 bottom
R13  33.81,2.67 0 bottom
R14  74.13,18.52 0 top
R15  74.01,11.42 0 top
R16  62.43,6.17 0 top
R17  74.16,22.82 180 top
R18  67.43,23.05 180 top
R19  74.13,21.42 0 top
R20  74.11,20.02 180 top
R21  73.98,12.82 0 top
R22  68.13,36.54 180 bottom
R23  64.63,40.57 180 bottom
R24  52.05,6.65 270 top
R25  45.31,7.7 180 top
R26  73.98,10 0 top
R27  52.03,10.15 270 top
R28  73.96,15.56 0 top
R29  45.23,11 180 top
R30  73.21,3.9 0 top
R31  52.11,3.15 270 top
R32  45.28,4.1 180 top
R33  58.53,4.34 180 top
R34  62.53,4.77 180 top
R35  68.03,42.12 0 bottom
R36  74.21,17.61 180 bottom
R37  74.01,8.61 0 top
R38  73.71,11.11 180 bottom
R39  76.36,7.01 0 top
R40  76.26,7.36 180 bottom
SPI-LED  6.61,5.65 90 top
ST  79.83,22.06 180 top
TH  79.83,19.52 180 top
U1  71.55,37.75 90 top
U$1  [MARK_POINT_3MM]  78.68,48.08 0 top
U$2  [MARK_POINT_3MM]  79.33,48.97 0 bottom
U$3  [MARK_POINT_3MM]  82.23,2.78 0 bottom
U$6  [MARK_POINT_3MM]  14.08,3.23 0 top
U$14  49.03,10.1 180 top
U$20  49.09,6.66 180 top
U$23  49.1,3.06 180 top
U$24  [LOGO_FABO_S]  85.86,37.46 90 top
X2  18.59,3.77 90 top

### Tracks (layer width: path | path; a pad name or v marks a point on that pad's centre or on a via)
3V3  (via drill 0.35)
  Top 0.152: 20.51,6.76 IC1.4 21.44,6.68 21.66,6.46 21.66,5.46 21.28,5.08 IC1.6 | ICSP1.2 35.2,8.86 33.66,8.86 32.46,7.66 32.46,5.66 31.61,4.81 30.11,4.81 29.66,4.36 28.87,4.36 IC1.18 28.69,4.38 25.88,4.38 25.26,3.76 v25.26,3.66 | U$20.5 48.4,5.71 48.96,6.26 | 48.96,6.26 48.96,8.56 | 48.96,6.26 48.96,2.66 48.4,2.11 U$23.5 44.91,2.11 42.96,4.06 42.96,4.23 42.95,4.24 42.95,5.9 R2.2 | 48.96,8.56 48.96,11.26 49.86,12.16 53.46,12.16 55.56,10.06 55.56,7.76 55.96,7.36 56.75,7.36 IC3.16 | C20.2 57.39,6.9 IC3.16 | C24.2 65.13,18.63 R11.2 64.96,21.44 v64.96,21.56 66.44,23.05 R18.2 | IC3.16 58.54,7.45 59.4,8.31 59.4,12.52 v59.1,12.82 | v14.46,5.76 14.46,5.79 | U$14.5 48.37,9.15 48.96,8.56 | 4.76,11.66 4.61,11.66 | 4.61,11.66 3.31,11.66 2.76,12.21 IC2.1 | 4.61,11.66 5.41,12.46 15.11,12.46 15.91,11.66 v17.26,11.66
  Top 0.3: 4.76,11.66 10.91,5.51 14.21,5.51 v14.46,5.76
  Top 0.305: v14.46,5.76 15.06,6.36 19.06,6.36 19.45,6.76 19.46,6.76 | 19.46,6.76 20.51,6.76 | 19.46,6.76 C3.2 18.76,7.71 18.31,8.16 C12.2
  Bottom 0.152: 58.06,17.46 54.66,17.46 54.06,16.86 54.06,15.86 53.41,15.21 23.86,15.21 23.08,14.44 IC2.17 23.08,13.64 21.66,12.21 17.81,12.21 v17.26,11.66 | 58.06,17.46 62.36,17.46 64.26,19.36 64.26,21.26 | 64.26,21.26 64.26,22.66 66.48,24.88 R7.1 67.75,27.06 69.36,27.06 69.96,27.66 69.96,28.26 70.66,28.96 71.46,28.96 72.06,28.36 72.06,27.26 72.21,27.11 | 72.21,27.11 72.36,26.96 76.06,26.96 76.46,27.36 76.46,31.86 75.57,32.75 75.56,32.75 | 75.56,32.75 U1.25 70.77,32.75 70.46,33.06 70.46,34.14 70.57,34.25 | 75.56,32.75 75.56,33.76 75.07,34.25 U1.22 70.57,34.25 | 64.26,21.26 64.56,21.56 v64.96,21.56 | v59.1,12.82 59.06,12.86 59.06,16.46 58.06,17.46 | v25.26,3.66 23.36,5.56 19.66,5.56 19.46,5.76 v14.46,5.76 | JP2.1 71.49,25.6 R9.1 71.38,26.28 72.21,27.11 | R23.1 63.78,39.04 64.52,38.3 D1.CATHODE 65.76,37.06 66.38,36.44 67.28,36.44 | 70.57,34.25 70.19,34.63 69.06,34.63 C6.2 | R22.1 67.28,36.44 | C2.2 17.54,10.55 | 17.54,10.55 17.26,10.83 v17.26,11.66 | C6.2 C7.2 | C6.2 67.28,36.41 67.28,36.44 | 17.46,11.86 v17.26,11.66 | IC4.28 16.49,10.29 16.74,10.55 17.54,10.55
  pour Top (no thermals): 2.06,11.96 2.06,12.91 1.91,13.06 1.91,14.71 1.96,14.76 3.56,14.76 3.61,14.71 3.66,14.66 3.66,12.91 4.11,12.46 5.31,12.46 5.81,11.96 5.81,11.46 5.41,11.06 4.91,11.06 4.56,11.06 4.11,11.51 2.51,11.51
5V
  Top 0.61: IC2.2 1.54,16.47 0.91,15.84 0.91,6.21 2.47,4.65 SPI-LED.VCC
AVR_MISO
  Top 0.152: ICSP1.1 34.69,6.06 33.66,6.06 32.16,4.56 32.16,4.26 30.08,2.18 IC1.16
AVR_MOSI  (via drill 0.35)
  Top 0.152: ICSP1.4 36.98,8.86 36.28,9.56 33.36,9.56 32.66,8.86 v32.16,8.86 | v26.56,3.56 26.69,3.43 IC1.15
  Bottom 0.152: v32.16,8.86 29.06,5.76 28.46,5.76 27.06,4.36 | v26.56,3.56 26.56,3.86 27.06,4.36 | SPI-LED.DI 5.67,8.65 7.06,7.26 14.36,7.26 15.35,6.27 23.75,6.27 25.66,4.36 27.06,4.36
AVR_RESET  (via drill 0.35)
  Top 0.152: IC1.29 24.29,9.43 v24.46,9.26 | v40.76,11.46 42.15,10.07 R2.1 42.12,8.36 41.46,8.36 41.16,8.06 41.16,5.96 40.56,5.36 38.06,5.36 37.76,5.66 37.76,6.59 ICSP1.5
  Bottom 0.152: v24.46,9.26 24.46,10.16 25.16,10.86 34.76,10.86 35.46,11.56 40.56,11.56 40.71,11.41 v40.76,11.46
AVR_RX  (via drill 0.35)
  Top 0.152: v24.36,7.66 23.49,8.53 IC1.30
  Bottom 0.152: v24.36,7.66 25.08,6.94 R12.2
AVR_SCK  (via drill 0.35)
  Top 0.152: ICSP1.3 35.36,5.46 34.26,5.46 v33.36,4.56 | SPI-LED.CI 11.22,0.76 29.86,0.76 v31.76,2.66 | IC1.17 29.88,3.48 v30.16,3.76
  Bottom 0.152: v31.76,2.66 30.66,3.76 v30.16,3.76 30.96,4.56 v33.36,4.56
AVR_TX  (via drill 0.35)
  Top 0.152: IC1.31 22.69,8.43 24.26,6.86 24.26,4.66 23.46,3.86 22.46,3.86 v21.96,4.36
  Bottom 0.152: v21.96,4.36 21.96,2.86 22.56,2.26 28.36,2.26 29.6,3.51 29.6,3.99 30.93,5.32 34.1,5.32 34.56,4.86 34.56,4.06 34.16,3.66 33.36,3.66 32.96,3.26 R13.2
CH1  (via drill 0.35)
  Top 0.152: IC3.2 61.49,8.1 v61.46,8.06 | v46.26,9.46 45.36,9.46 44.38,10.44 R29.2 43.52,11 v43.26,11.26 | v30.36,9.66 30.36,9.06 29.58,8.28 IC1.23
  Bottom 0.152: v46.26,9.46 47.66,8.06 v61.46,8.06 | v43.26,11.26 42.86,11.26 41.66,10.06 40.26,10.06 39.86,10.46 37.36,10.46 36.96,10.06 30.76,10.06 v30.36,9.66
CH2  (via drill 0.35)
  Top 0.152: v46.16,5.96 45.06,5.96 44.46,6.56 R25.2 v44.46,9.06 | v61.56,10.56 62.07,10.05 IC3.5 | v27.26,8.26 27.26,8.86 27.48,9.08 IC1.24
  Bottom 0.152: v46.16,5.96 46.46,6.26 62.46,6.26 63.16,6.96 63.16,8.46 61.56,10.06 v61.56,10.56 | v27.26,8.26 27.66,7.86 29.96,7.86 31.66,9.56 38.36,9.56 38.66,9.86 39.86,9.86 40.16,9.56 43.96,9.56 v44.46,9.06
CH3
  Top 0.152: R32.2 44.02,4.1 43.51,4.61 43.51,9.81 41.06,12.26 40.46,12.26 40.06,11.86 36.49,11.86 36.49,11.87 35.55,11.87 35.21,12.21 33.81,12.21 32.91,11.31 26.91,11.31 26.69,11.09 IC1.26
D3
  Top 0.152: IC1.1 19.36,10.31 17.21,10.31 16.66,10.86 15.96,10.86 14.86,11.96 11.89,11.96 JETSON1.ANODE
D4
  Top 0.152: 14.31,11.41 JETSON.ANODE 14.97,11.15 16.26,9.86 18.96,9.86 19.56,9.26 19.56,8.56 19.84,8.28 IC1.2 20.19,8.28
GND  (via drill 0.35)
  Top 0.152: U$14.3 51.97,11.05 | 51.97,11.05 R27.1 | X2.2 17.45,3.77 16.76,4.46 v16.76,5.06 16.76,5.46 17.03,5.73 20.44,5.73 IC1.5 | IC1.21 29.64,6.68 29.66,6.66 29.9,6.66 30.68,7.44 | 30.68,7.44 C1.1 | C12.1 16.61,7.26 | C3.1 16.86,7.26 16.61,7.26 | ST.GND TH.GND 1.GND 2.GND 3.GND 82.37,8.27 76.06,1.96 71.36,1.96 | 70.68,19.04 v70.73,19.04 70.56,18.86 67.84,18.86 67.03,18.06 C24.1 66.83,17.59 66.06,16.81 v65.06,16.81 64.41,16.81 v63.61,17.61 63.61,18.11 65.11,19.61 v65.11,19.91 | R16.1 61.47,6.06 61.06,6.06 v60.36,5.36 | v55.06,4.96 55.06,5.53 C20.1 55.06,6.79 55.06,9.36 53.86,10.56 v53.46,10.56 52.97,11.05 51.97,11.05 | v53.46,8.76 53.46,7.86 53.26,7.66 52.22,7.66 R24.1 51.94,7.61 U$20.3 50.35,7.56 49.66,7.56 49.46,7.36 49.46,4.61 50.06,4.01 | R31.1 50.41,4 U$23.3 50.06,4.01 | 30.68,7.44 30.68,8.69 31.96,9.96 36.8,9.96 | 49.26,0.76 47.66,0.76 47.06,1.36 43.73,1.36 42,3.09 CN1.3 | 71.36,1.96 v67.96,1.96 | 50.06,4.01 49.8,4.01 49.46,3.66 49.46,0.96 49.26,0.76 | v74.61,6.01 73.66,6.01 M5.S | IC1.3 21.94,7.48 v22.06,7.36 | v15.66,7.26 16.61,7.26 | v55.46,10.95 54.96,11.45 v54.96,12.57 55.06,12.66 58.26,12.66 58.46,12.46 58.46,8.46 58.09,8.1 IC3.15 | 38.16,8.46 38.15,8.45 ICSP1.6 38.25,8.51 36.8,9.96 | 36.8,9.96 35.2,11.56 v34.26,11.56 | IC2.39 50.99,13.93 49.76,15.16 44.71,15.16 IC2.34 42.14,15.21 39.32,15.21 38.32,16.21 | v74.46,44.16 73.76,44.86 65.66,44.86 v65.06,44.26 65.06,35.26 v65.56,34.76 | v65.56,34.76 66.86,33.46 v73.26,33.46 | R5.1 11.31,9.92 12.11,9.12 12.11,7.71 | v15.66,7.26 12.56,7.26 12.11,7.71 | R10.1 15.01,7.91 v15.66,7.26 | 12.11,7.71 12.11,7.11 v11.46,6.46
  Top 0.152: v67.96,1.96 66.59,1.96 65.39,0.76 49.26,0.76 | IC2.9 12.92,14.18 13.96,15.21 16.76,15.21 18,16.46 IC2.14 19.27,15.21 24.36,15.21 | v25.51,12.21 25.21,12.21 24.36,13.06 24.36,15.21 | 24.36,15.21 IC2.20 25.7,16.47 26.96,15.21 34.21,15.21 | 34.21,15.21 37.71,15.21 38.32,15.83 38.32,16.21 | IC2.25 34.21,14.9 34.21,15.21 | 38.32,16.21 IC2.30 | M1.S 71.51,12.91 70.51,11.91 v67.86,11.91 | v67.46,14.36 67.51,14.36 | 67.51,14.36 67.61,14.36 M2.S | M3.S 70.16,8.76 v69.51,9.41 | M4.S 66.76,9.73 v66.69,9.8 | M6.S 69.76,3.56 71.36,1.96 | v67.96,1.96 67.96,3.26 67.25,3.97 67.25,5.27 67.26,5.28 v67.26,5.76 | v59.91,16.46 61.41,17.96 61.86,17.96 63.11,19.21 v63.11,20.11 | v54.06,14.56 53.21,15.41 v53.21,17.36 | v62.61,13.26 63.4,12.47 IC3.8 64.16,12.76 v64.26,12.76 64.26,14.11 64.41,14.26 v64.41,15.21 66.66,15.21 67.51,14.36 | v3.26,7.51 3.61,7.16 v3.61,5.91 | SPI-LED.GND 4.32,2.65 v3.41,3.56 3.41,3.11 v2.06,1.76 | v65.11,24.51 67.51,24.51 v67.56,24.56 | v68.36,26.06 69.86,24.56 v70.76,24.56 70.91,24.71 v73.81,24.71 | v78.41,27.81 78.21,28.01 v78.21,31.51 76.76,32.96 v76.76,34.26 | v74.76,37.61 74.71,37.56 v74.71,35.31 74.81,35.21 v74.81,33.46 | v65.56,34.76 65.96,34.76 72.86,41.66 v74.86,41.66 | v9.06,6.06 7.71,6.06 v7.61,6.16
  Bottom 0.152: R3.1 R1.1 12.7,11.72 | v60.36,5.36 60.26,5.46 55.56,5.46 v55.06,4.96 | v53.46,8.76 v53.46,10.56 53.51,10.51 53.95,10.95 v55.46,10.95 | v64.26,12.76 64.26,11.91 66.38,9.8 v66.69,9.8 69.13,9.8 v69.51,9.41 | 74.71,6.01 v74.61,6.01 73.76,6.01 72.58,7.19 | 74.71,6.01 77.46,6.01 | 77.46,6.01 80.31,6.01 82.37,8.07 3.GND | 72.58,7.19 71.18,8.59 70.33,8.59 v69.51,9.41 | v22.06,7.36 15.76,7.36 v15.66,7.26 | IC4.24 13.89,10.43 12.7,11.62 12.7,11.72 | 7.46,2.65 7.64,2.65 8.04,3.04 IC4.14 8.04,5.04 | 7.46,2.65 SPI-LED.GND 2.87,2.65 1.36,4.16 1.36,14.96 1.61,15.21 12.66,15.21 13.01,14.86 12.92,14.78 IC2.9 12.92,11.94 12.7,11.72 | 8.04,5.04 8.26,5.26 11.06,5.26 | 13.89,4.83 IC4.5 | 11.06,5.26 12.96,5.26 | 12.96,5.26 13.46,5.26 13.89,4.83 | IC4.4 14.54,4.78 | 14.54,4.78 14.46,4.86 13.92,4.86 13.89,4.83 | IC4.3 15.19,4.83 | 15.19,4.83 15.16,4.86 14.62,4.86 14.54,4.78 | IC4.2 15.84,4.88 | 15.84,4.88 15.76,4.96 15.32,4.96 15.19,4.83 | 16.49,4.86 IC4.1 16.41,3.77 v16.41,2.31 | 16.49,4.86 16.49,4.93 16.46,4.96 15.92,4.96 15.84,4.88 | 16.49,4.86 16.69,5.06 v16.76,5.06 | 25.11,12.21 23.86,10.96 21.35,10.96 20.99,10.61 19.54,10.61 C2.1 20.4,11.46 v20.61,11.46 | 25.11,12.21 v25.51,12.21 27.51,12.21 v27.66,12.06 v30.01,12.06 v32.46,12.06 33.76,12.06 34.21,11.61 | U1.2 73.06,44.26 73.46,43.86 | U1.6 73.15,42.25 73.46,42.56 | 73.46,43.86 73.46,42.56 | U1.10 73.26,40.26 73.46,40.46 73.46,40.76 | 73.46,40.76 73.46,41.26 | 73.46,41.26 73.46,41.76 | 73.46,41.76 73.46,42.56 | U1.7 73.45,41.75 73.46,41.76 | U1.8 73.45,41.25 73.46,41.26 | U1.9 73.45,40.75 73.46,40.76 | 67.23,43.46 C9.1 C8.1 67.23,45.79 v68.16,46.71 | 67.23,43.46 67.23,42.18 R35.2
  Bottom 0.152: C11.1 63.83,42.94 64.46,43.56 64.56,43.56 | 64.56,43.56 67.13,43.56 67.23,43.46 | 64.56,43.56 65.01,44.01 | 65.01,44.01 65.06,44.06 v65.06,44.26 | 74.38,44.09 v74.46,44.16 77.31,41.31 77.31,35.31 | 74.38,44.09 74.16,43.86 73.46,43.86 | C7.1 C6.1 v65.56,34.76 65.56,35.31 v63.46,37.41 v63.46,33.91 63.51,33.86 v63.51,30.56 63.51,27.51 v63.56,27.46 | U1.14 72.97,38.25 73.06,38.16 73.06,37.76 | 73.06,37.76 73.06,37.36 | 73.06,37.36 72.95,37.25 U1.16 | U1.15 73.05,37.75 73.06,37.76 | 73.06,37.36 73.06,36.26 | 73.06,36.26 73.06,35.76 | 73.06,35.76 73.06,34.86 72.96,34.76 U1.21 | U1.18 73.06,36.26 | U1.19 73.06,35.76 | ST.GND 82.37,27.25 79.16,30.46 79.16,33.46 77.31,35.31 | 73.06,36.26 76.36,36.26 77.31,35.31 | U1.23 72.96,33.76 v73.26,33.46 73.31,33.41 74.56,33.41 74.61,33.46 v74.81,33.46 | 34.21,11.61 v34.26,11.56 | v11.46,6.46 11.46,5.66 11.06,5.26 | v13.36,6.56 13.36,5.66 12.96,5.26 | IC2.25 34.21,12.96 34.21,11.61 | IC2.39 53.59,13.93 53.94,13.59 | 53.94,13.59 v54.96,12.57 57.31,12.57 57.76,13.01 57.76,14.01 v58.36,14.61 | R36.2 75.06,18.86 74.96,18.96 70.73,18.96 v70.73,19.04 | 74.56,10.89 R38.2 74.56,9.16 72.58,7.19 | 77.46,6.01 77.46,7.01 R40.2 78.06,7.36 v78.66,7.96 80.76,7.96 v80.91,8.11 | v67.86,11.91 67.86,13.96 v67.46,14.36 | v69.51,9.41 69.46,9.46 68.46,8.46 68.46,6.96 v67.26,5.76 | v63.11,20.11 63.11,21.91 v63.51,22.31 63.51,22.81 65.11,24.41 v65.11,24.51 | v60.46,14.51 59.91,15.06 v59.91,16.46 | 61.73,15.74 v61.76,15.76 v63.61,17.61 | 61.73,15.74 60.51,14.51 v60.46,14.51 | v63.01,14.81 62.66,14.81 61.73,15.74 | v63.01,14.81 63.41,15.21 v64.41,15.21 | v62.61,13.26 62.63,13.29
  Bottom 0.152: 62.63,13.29 63.01,13.66 v63.01,14.81 | 62.63,13.29 61.43,13.29 v61.01,12.86 60.46,13.41 v60.46,14.51 | v54.06,14.56 54.06,13.71 53.94,13.59 | v3.41,3.56 3.41,5.71 v3.61,5.91 | v7.61,6.16 8.04,5.73 8.04,5.04 | 7.46,2.65 7.46,1.56 v7.56,1.46 10.76,1.46 v11.31,2.01 | v23.21,11.81 23.61,12.21 25.11,12.21 | v72.51,1.26 v74.96,1.26 74.96,2.96 v75.61,3.61 | v75.61,3.61 75.61,5.11 74.71,6.01 | v75.61,3.61 76.36,3.61 v77.26,4.51 79.86,4.51 v80.06,4.31 81.21,5.46 v81.46,5.46 82.46,6.46 v82.96,6.46 v85.16,6.46 | v85.16,6.46 v85.16,3.81 | v85.16,6.46 85.16,8.91 v85.11,8.96 85.11,11.96 v85.16,12.01 85.16,14.51 v85.11,14.56 85.11,17.11 v85.06,17.16 85.06,23.56 v84.16,24.46 85.26,25.56 v85.51,25.56 84.16,26.91 v84.16,27.91 | v80.11,34.81 79.91,35.01 v79.91,39.66 v79.91,44.26 | v79.91,44.26 78.46,44.26 v77.26,45.46 76.81,45.91 v76.81,50.06 76.76,50.01 v72.71,50.01 v68.11,50.01 v63.36,50.01 63.41,49.96 v63.41,45.81 65.01,44.21 65.01,44.01 | v79.91,44.26 80.61,44.96 80.61,46.31 81.36,47.06 v83.86,47.06 83.91,47.11 v83.91,49.91 | v67.56,24.56 67.56,25.26 v68.36,26.06 | v76.76,34.26 75.71,35.31 v74.71,35.31 | v74.76,37.61 76.21,37.61 v76.46,37.36 | v76.31,40.76 75.76,40.76 v74.86,41.66 74.86,42.56 74.38,43.04 74.38,44.09 | CN1.3 42.76,3.87 42.76,4.46 43.81,5.51 v44.31,5.51
  pour Top (rank 6): -13.59,-9.54 -13.59,63.36 96.21,63.36 96.21,-9.54
  pour Bottom (rank 6): -11.94,62.46 94.91,62.46 94.91,-7.99 -11.94,-7.99
J_CH1
  Top 0.152: R33.1 59.38,4.98 59.56,5.16 59.56,7.56 60.74,8.75 IC3.3
J_CH2
  Top 0.152: R34.1 63.86,4.77 65.61,6.51 65.61,9.16 64.07,10.7 IC3.6
N$2  (via drill 0.35)
  Top 0.152: 72.74,15.93 R28.1 72.51,16.16 v71.86,16.16 | v70.41,17.06 69.82,16.47 69.82,15.65 69.61,15.45 M1.G
  Bottom 0.152: v70.41,17.06 72.11,17.06 | 72.11,17.06 72.41,17.06 72.96,17.61 R36.1 | v71.86,16.16 71.86,16.81 72.11,17.06
N$3
  Top 0.152: 72.04,22.3 Q1.D 72.42,22.82 R17.2 73.28,22.8 R19.1 72.95,21.75
N$4
  Top 0.152: IC1.20 28.81,5.86 28.86,5.91 C1.2
N$5
  Top 0.152: X2.3 18.69,2.66 19.57,2.66 20.39,3.48 IC1.8
N$6  (via drill 0.35)
  Top 0.152: v20.56,1.86 20.56,2.11 21.71,3.26 23.76,3.26 26.16,5.66 v26.16,5.76
  Bottom 0.152: R12.1 26.78,6.39 v26.16,5.76 | v20.56,1.86 22.13,1.86 22.23,1.76 28.95,1.76 29.16,1.96 31.26,1.96 31.56,1.66 35.96,1.66 36.92,2.62 CN1.1
N$7
  Bottom 0.152: R3.2 10.06,11.07 10.06,10.86 10.26,10.66 13.06,10.66 13.24,10.48 IC4.23
N$8
  Bottom 0.152: IC4.25 14.46,9.78 14.46,11.46 14.33,11.59 R1.2
N$9
  Top 0.152: R20.2 71.92,20.02 Q2.D 72.35,18.52 R14.1
N$10
  Top 0.152: R17.1 75.41,22.42 76.41,22.42 76.47,22.36 76.99,22.36 ST.I/O
N$11
  Top 0.152: M2.G 67.46,12.61 70.11,12.61 70.56,13.06 M1.D 71.56,16.96 R4.1
N$12  (via drill 0.35)
  Top 0.152: R6.1 73.11,14.21 72.96,14.36 72.31,14.36 v71.66,15.01 | M2.D 67.56,15.96 v68.46,15.06
  Bottom 0.152: v71.66,15.01 71.22,15.45 D3.2 68.85,15.45 v68.46,15.06
N$13
  Top 0.152: 2.I/O 76.01,11.84 76.01,8.91 75.71,8.61 R37.2
N$14
  Top 0.152: 75.4,20.02 R20.1 75.27,19.71 77.09,19.71 TH.I/O
N$15
  Top 0.152: IC1.7 20.49,4.38 19.84,4.38 19.25,4.97 X2.1
N$16
  Bottom 0.152: U1.27 70.45,31.75 69.76,31.06 67.86,31.06 67.23,31.69 C4.2
N$17
  Bottom 0.152: 35.05,2.67 R13.1 35.26,3.27 35.26,4.76 35.81,5.31 38.24,5.31 39.46,4.09 CN1.2
N$18  (via drill 0.35)
  Top 0.152: 73.2,11.42 R15.1 | R15.1 73.16,11.26 | R15.1 72.8,11.06 M3.D 69.31,10.91 68.71,10.91 67.9,10.1 67.9,7.6 v67.31,7.01 | v64.81,7.36 64.81,8.61 M4.G
  Bottom 0.152: v67.31,7.01 65.16,7.01 v64.81,7.36
N$19
  Top 0.152: JETSON1.CATHODE R5.2
N$20
  Top 0.152: R10.2 12.45,10.18 JETSON.CATHODE
N$21
  Bottom 0.152: U1.26 69.18,32.25 C4.1
N$22
  Bottom 0.152: C5.1 67.23,29.74 68.16,30.66 69.96,30.66 70.55,31.25 U1.28
N$23
  Bottom 0.152: 69.43,29.63 C5.2 69.06,29.76 69.96,29.76 70.16,29.96 70.16,30.26 70.65,30.75 U1.29
N$24
  Bottom 0.152: U1.5 70.65,42.75 70.02,42.12 R35.1
N$25
  Bottom 0.152: U1.4 69.97,43.25 69.69,43.53 C9.2
N$26
  Bottom 0.152: U1.3 70.57,43.75 70.46,43.86 70.46,44.66 70.01,45.11 C8.2
N$27
  Bottom 0.152: U1.17 70.67,36.75 70.16,37.26 70.16,39.26 68.93,40.49 R8.2
N$28
  Bottom 0.152: 68.93,38.33 D1.ANODE 67.95,39.26 67.46,39.26 67.16,39.56 67.16,40.49 | C11.2 65.48,42.03 65.48,40.66 | 65.48,40.66 R23.2 | R8.1 67.16,40.49 | 67.16,40.49 65.65,40.49 65.48,40.66
N$29  (via drill 0.35)
  Top 0.152: R21.1 73.02,12.71 72.34,12.71 71.85,12.22 v71.85,12.02 | v66.71,11.06 65.91,11.06 M4.D
  Bottom 0.152: v71.85,12.02 71.28,12.59 D2.2 68.44,11.11 66.76,11.11 v66.71,11.06
N$30  (via drill 0.35)
  Top 0.152: v66.48,12.25 66.58,12.25 67.46,11.36 67.46,8.26 66.51,7.31 66.51,4.51 64.56,2.56 54.86,2.56 53.66,3.76 53.66,5.26 53.12,5.8 R24.2 51.19,6.66 U$20.2
  Bottom 0.152: D2.1 v66.48,12.25
N$31
  Top 0.152: U$20.4 46.25,7.61 R25.1
N$32
  Top 0.152: R39.2 77.21,10.5 3.I/O
N$33
  Top 0.152: R26.1 71.89,10 71.31,9.41 71.31,8.26 71.96,7.61 M5.D 70.56,6.16 69.16,6.16 M6.G
N$34  (via drill 0.35)
  Top 0.152: U$14.2 51.22,10.1 R27.2 52.23,9.5 53.82,9.5 54.36,8.96 54.36,4.36 55.46,3.26 63.96,3.26 66.06,5.36 66.06,9.39 64.86,10.59 64.86,12.67 v65.31,13.12
  Bottom 0.152: v65.31,13.12 65.31,13.93 66.48,15.1 D3.1
N$35
  Top 0.152: R29.1 46.14,11.05 U$14.4
N$36  (via drill 0.35)
  Top 0.152: M6.D 69.33,7.68 v70.45,7.68 | R30.1 70.92,3.9 v70.86,3.96
  Bottom 0.152: v70.45,7.68 D4.2 69.45,4.97 70.46,3.96 v70.86,3.96
N$37  (via drill 0.35)
  Top 0.152: v66.73,3.24 65.15,1.66 52.75,1.66 R31.2 51.92,2.3 51.16,3.06 U$23.2
  Bottom 0.152: v66.73,3.24 D4.1
N$38
  Top 0.152: U$23.4 47.71,4.1 R32.1
N$39
  Top 0.152: R11.1 68.2,19.9 Q2.G
N$40
  Top 0.152: R18.1 69.4,23.05 Q1.G
N$41  (via drill 0.35)
  Top 0.152: R14.2 74.8,18.52 74.11,19.21 74.11,20.85 74.68,21.42 R19.2 75.6,21.42 v76.21,20.81
  Bottom 0.152: v76.21,20.81 78.21,20.81 78.51,21.11 78.51,23.76 77.78,24.49 JP2.2
N$42  (via drill 0.35)
  Top 0.152: R33.2 56.18,4.34 v56.16,4.36
  Bottom 0.152: v56.16,4.36 48.86,4.36 45.76,1.26 14.56,1.26 13.24,2.58 IC4.6
N$43  (via drill 0.35)
  Top 0.152: R34.2 60.77,3.86 v60.76,3.86
  Bottom 0.152: v60.76,3.86 57.56,0.66 13.56,0.66 12.59,1.63 IC4.7
N$44
  Top 0.152: R28.2 77.19,15.56 1.I/O
N$45  (via drill 0.35)
  Top 0.152: R37.1 72.65,9.12 v72,9.12 | M3.G 68.51,9.56 69.16,10.21 v70.81,10.21
  Bottom 0.152: R38.1 72.68,10.94 | 72.68,10.94 72.61,10.86 | v72,9.12 71.81,9.31 71.81,10.31 71.88,10.39 | 71.88,10.39 72.43,10.94 72.68,10.94 | v70.81,10.21 70.98,10.39 71.88,10.39
N$46  (via drill 0.35)
  Top 0.152: R39.1 75.19,7.33 74.26,7.33 v73.96,7.03 73.91,7.08 72.85,7.08 72.48,6.71 71.76,6.71 71.01,5.96 M5.G
  Bottom 0.152: R40.1 74.29,7.36 v73.96,7.03
N$50
  Bottom 0.152: R22.2 69.68,36.54 70.36,35.86 70.36,35.46 70.57,35.25 U1.20
RCH1  (via drill 0.35)
  Top 0.152: v63.36,16.16 60.16,12.96 60.16,10.16 60.96,9.36 63.36,9.36 IC3.4 | Q1.S 69.45,21.5 66.96,21.5 66.96,21.51 66.81,21.36 v66.66,21.36
  Bottom 0.152: v66.66,21.36 66.66,19.46 v63.36,16.16
RCH2
  Top 0.152: 63.06,11.35 IC3.7 62.27,11.35 61.76,11.86 61.76,13.66 62.11,14.01 63.46,14.01 63.71,14.26 63.71,15.51 64.26,16.06 66.11,16.06 66.86,16.81 67.71,16.81 68.9,18 Q2.S
SCL  (via drill 0.35)
  Top 0.152: IC1.28 25.09,11.43 25.06,11.46 | 25.06,11.46 23.96,12.56 16.31,12.56 v16.16,12.41 | 25.06,11.46 26.06,11.46 27.28,12.69 53.04,12.69 53.06,12.66 53.56,12.66 54.18,13.28 58.04,13.28 64.31,19.54 64.31,20.16 62.71,21.76 62.71,23.11 v63.26,23.66 | v68.56,28.06 71.16,30.66 73.26,30.66 73.96,31.36 73.96,38.06 v73.76,38.26
  Bottom 0.152: v16.16,12.41 15.29,11.54 15.29,9.8 IC4.26 15.19,8.79 14.96,8.56 7.76,8.56 7.36,8.96 7.36,13.45 IC2.5 | v63.26,23.66 64.78,25.18 R7.2 67.05,28.06 v68.56,28.06 | v73.76,38.26 73.66,38.26 73.16,38.76 U1.13
SDA  (via drill 0.35)
  Top 0.152: v25.66,8.76 25.96,9.06 25.96,10.31 IC1.27 | v70.96,27.96 71.96,28.96 72.86,28.96 75.61,31.71 75.61,38.71 v74.86,39.46
  Bottom 0.152: 15.56,8.26 15.16,7.86 7.66,7.86 6.66,8.86 6.66,10.26 5.3,11.62 IC2.3 | 15.56,8.26 15.84,8.54 IC4.27 | v70.96,27.96 70.96,27 R9.2 69.06,25.1 69.06,18.96 66.56,16.46 65.71,16.46 65.01,15.76 65.01,14.61 62.41,12.01 42.4,12.01 40.95,10.56 40.46,10.56 40.06,10.96 36.96,10.96 36.46,10.46 28.26,10.46 26.56,8.76 v25.66,8.76 25.36,8.46 24.06,8.46 23.86,8.26 15.56,8.26 | v74.86,39.46 73.06,39.46 | U1.12 72.85,39.25 73.06,39.46 | U1.11 72.77,39.75 73.06,39.46
SEL  (via drill 0.35)
  Top 0.152: IC1.32 21.89,8.53 23.06,7.36 v23.06,4.66 | R16.2 63.28,7.33 IC3.1 63.2,7.25 60.74,7.25 v60.66,7.16
  Bottom 0.152: v60.66,7.16 44.36,7.16 42.96,5.76 30.26,5.76 27.26,2.76 24.76,2.76 23.06,4.46 v23.06,4.66
VCC_RC
  Top 0.152: 75.16,17.11 R4.2 75.46,17.41 77.72,17.41 TH.VCC | 1.VCC 79.83,15.33 78.83,14.34 74.96,14.34 R6.2 74.83,14.17 R21.2 74.86,12.8 R15.2 74.83,11.4 R26.2 74.93,9.9 | R30.2 75.51,5.35 77.39,5.35 79.88,7.83 79.88,10.53 3.VCC
  Bottom 0.152: JP2.3 80.5,23.9 80.5,22.73 79.87,22.1
  Bottom 1.27: 3.VCC 2.VCC 1.VCC TH.VCC ST.VCC 79.87,22.1
  pour Bottom (no thermals): 78.76,9.01 78.76,20.36 79.01,20.61 79.01,22.76 79.31,23.06 80.56,23.06 80.91,22.71 80.91,9.31 80.51,8.91 78.86,8.91
  pour Top (no thermals): 78.71,9.36 78.71,22.76 79.26,23.31 80.36,23.31 80.96,22.71 80.96,9.36 80.66,9.06 79.01,9.06

### Text on the board
tPlace: 1 | JETSON | RC | R | T | G | #612 | Designed in Aizu | REV 2.0.13
bPlace: 3v3 | RC | S/N | F-612-2-13-A-N-J-0-P
tDocu: OLED AREA | RX | TX | GND